# EAGLE schematic TX16S_enhanced (EAGLE 7.7.0)
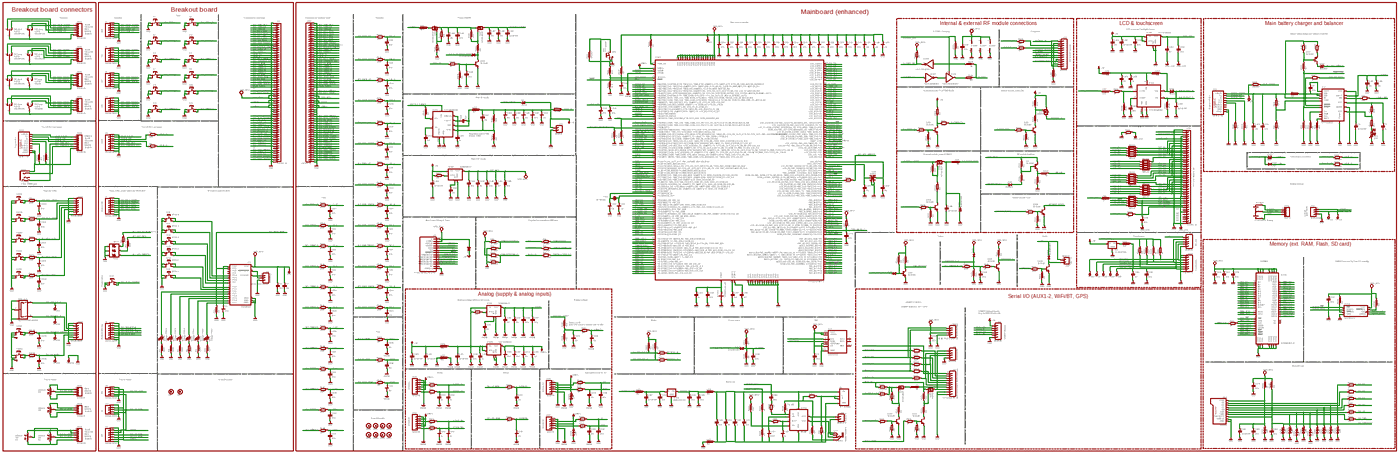
[diagram p0: schematic, sheet 1, overview]
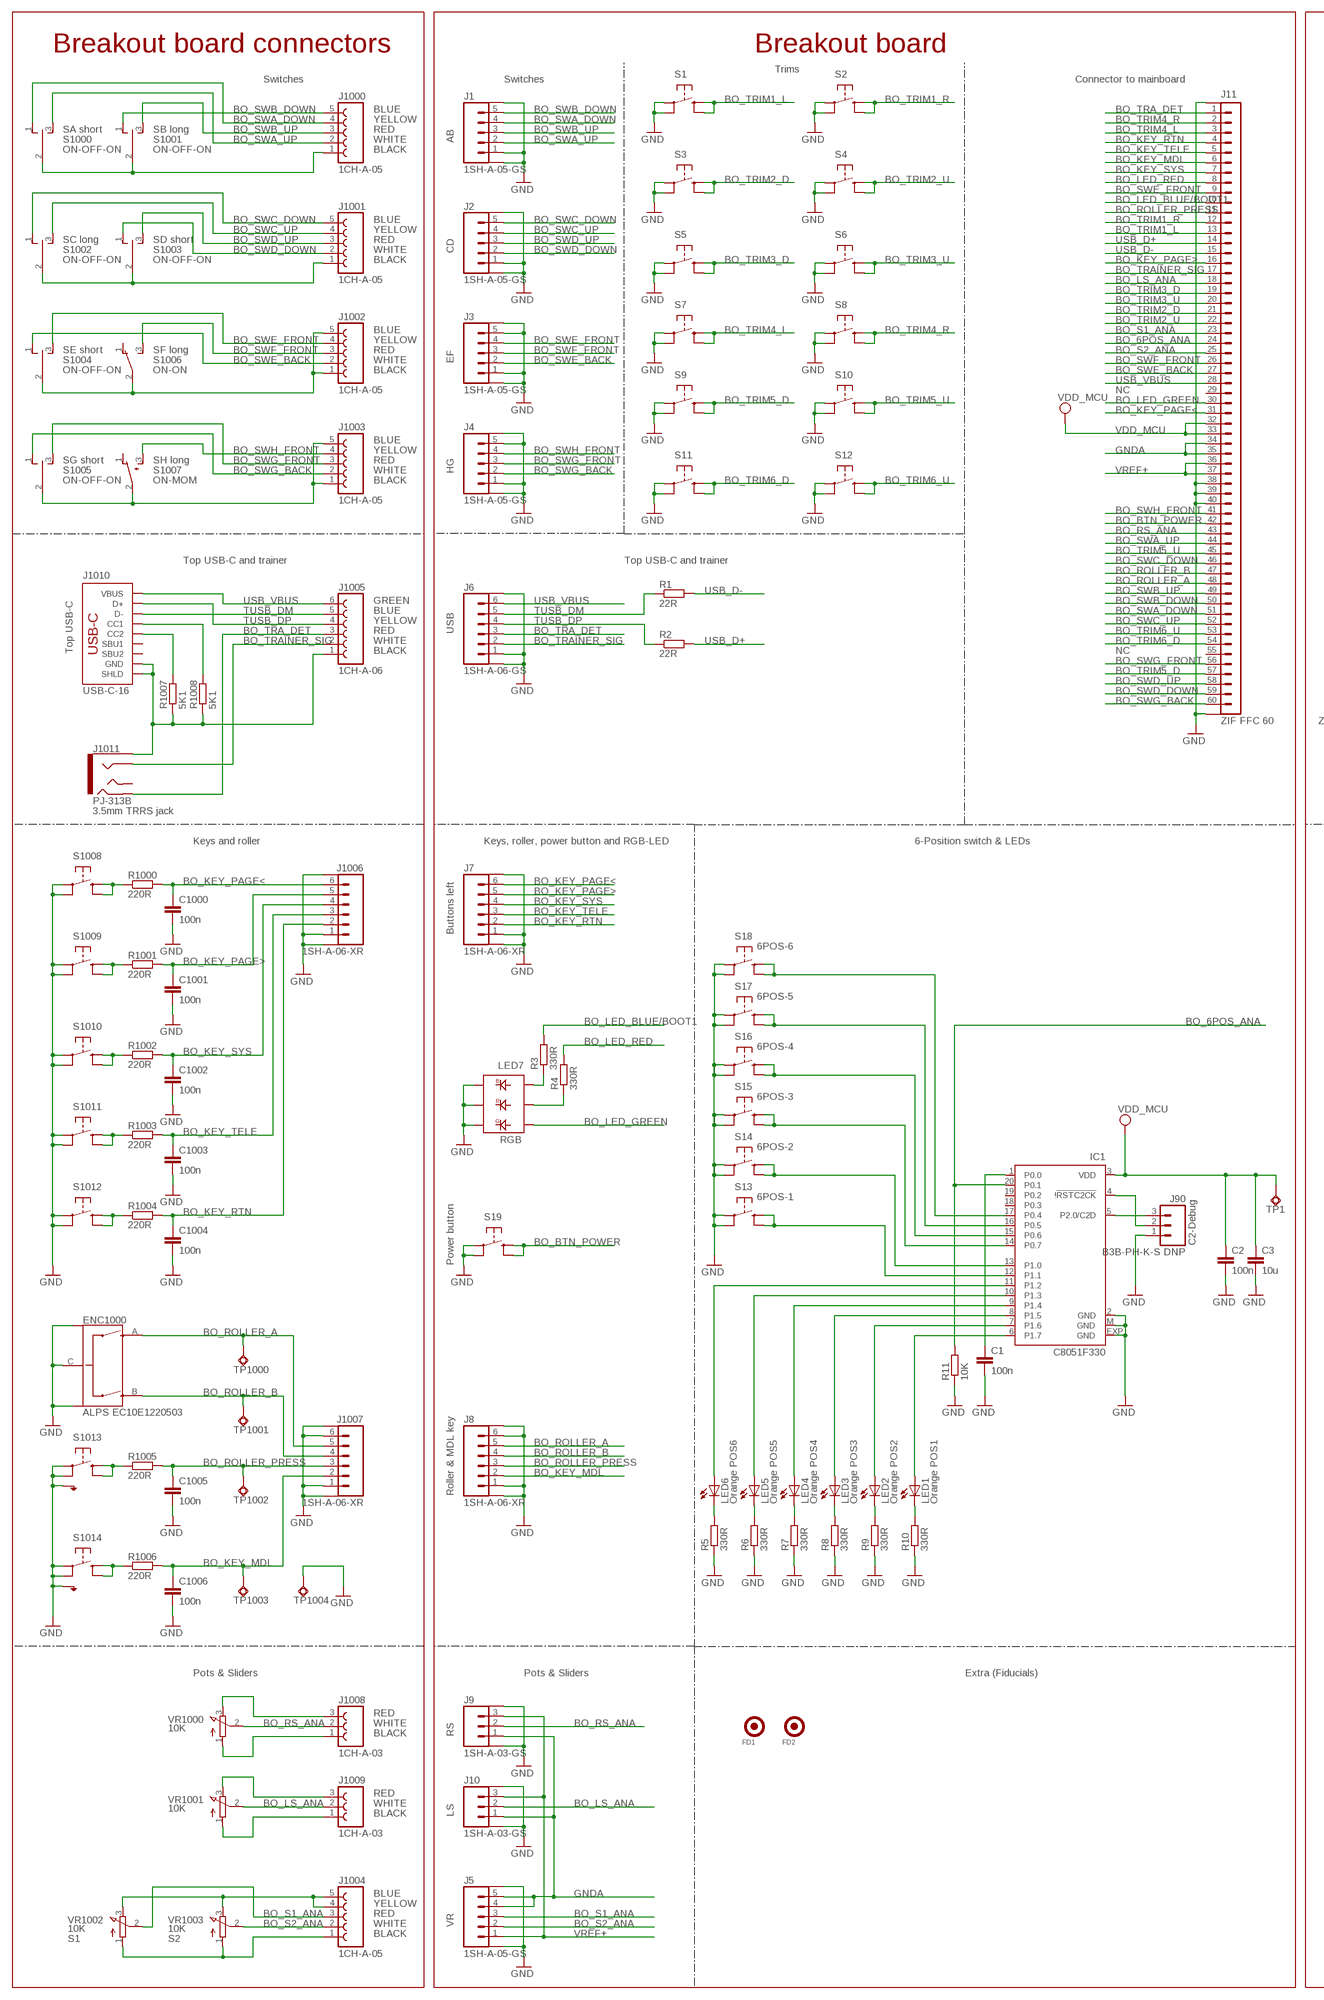
[diagram p1: schematic, sheet 1, part 1 of 4]
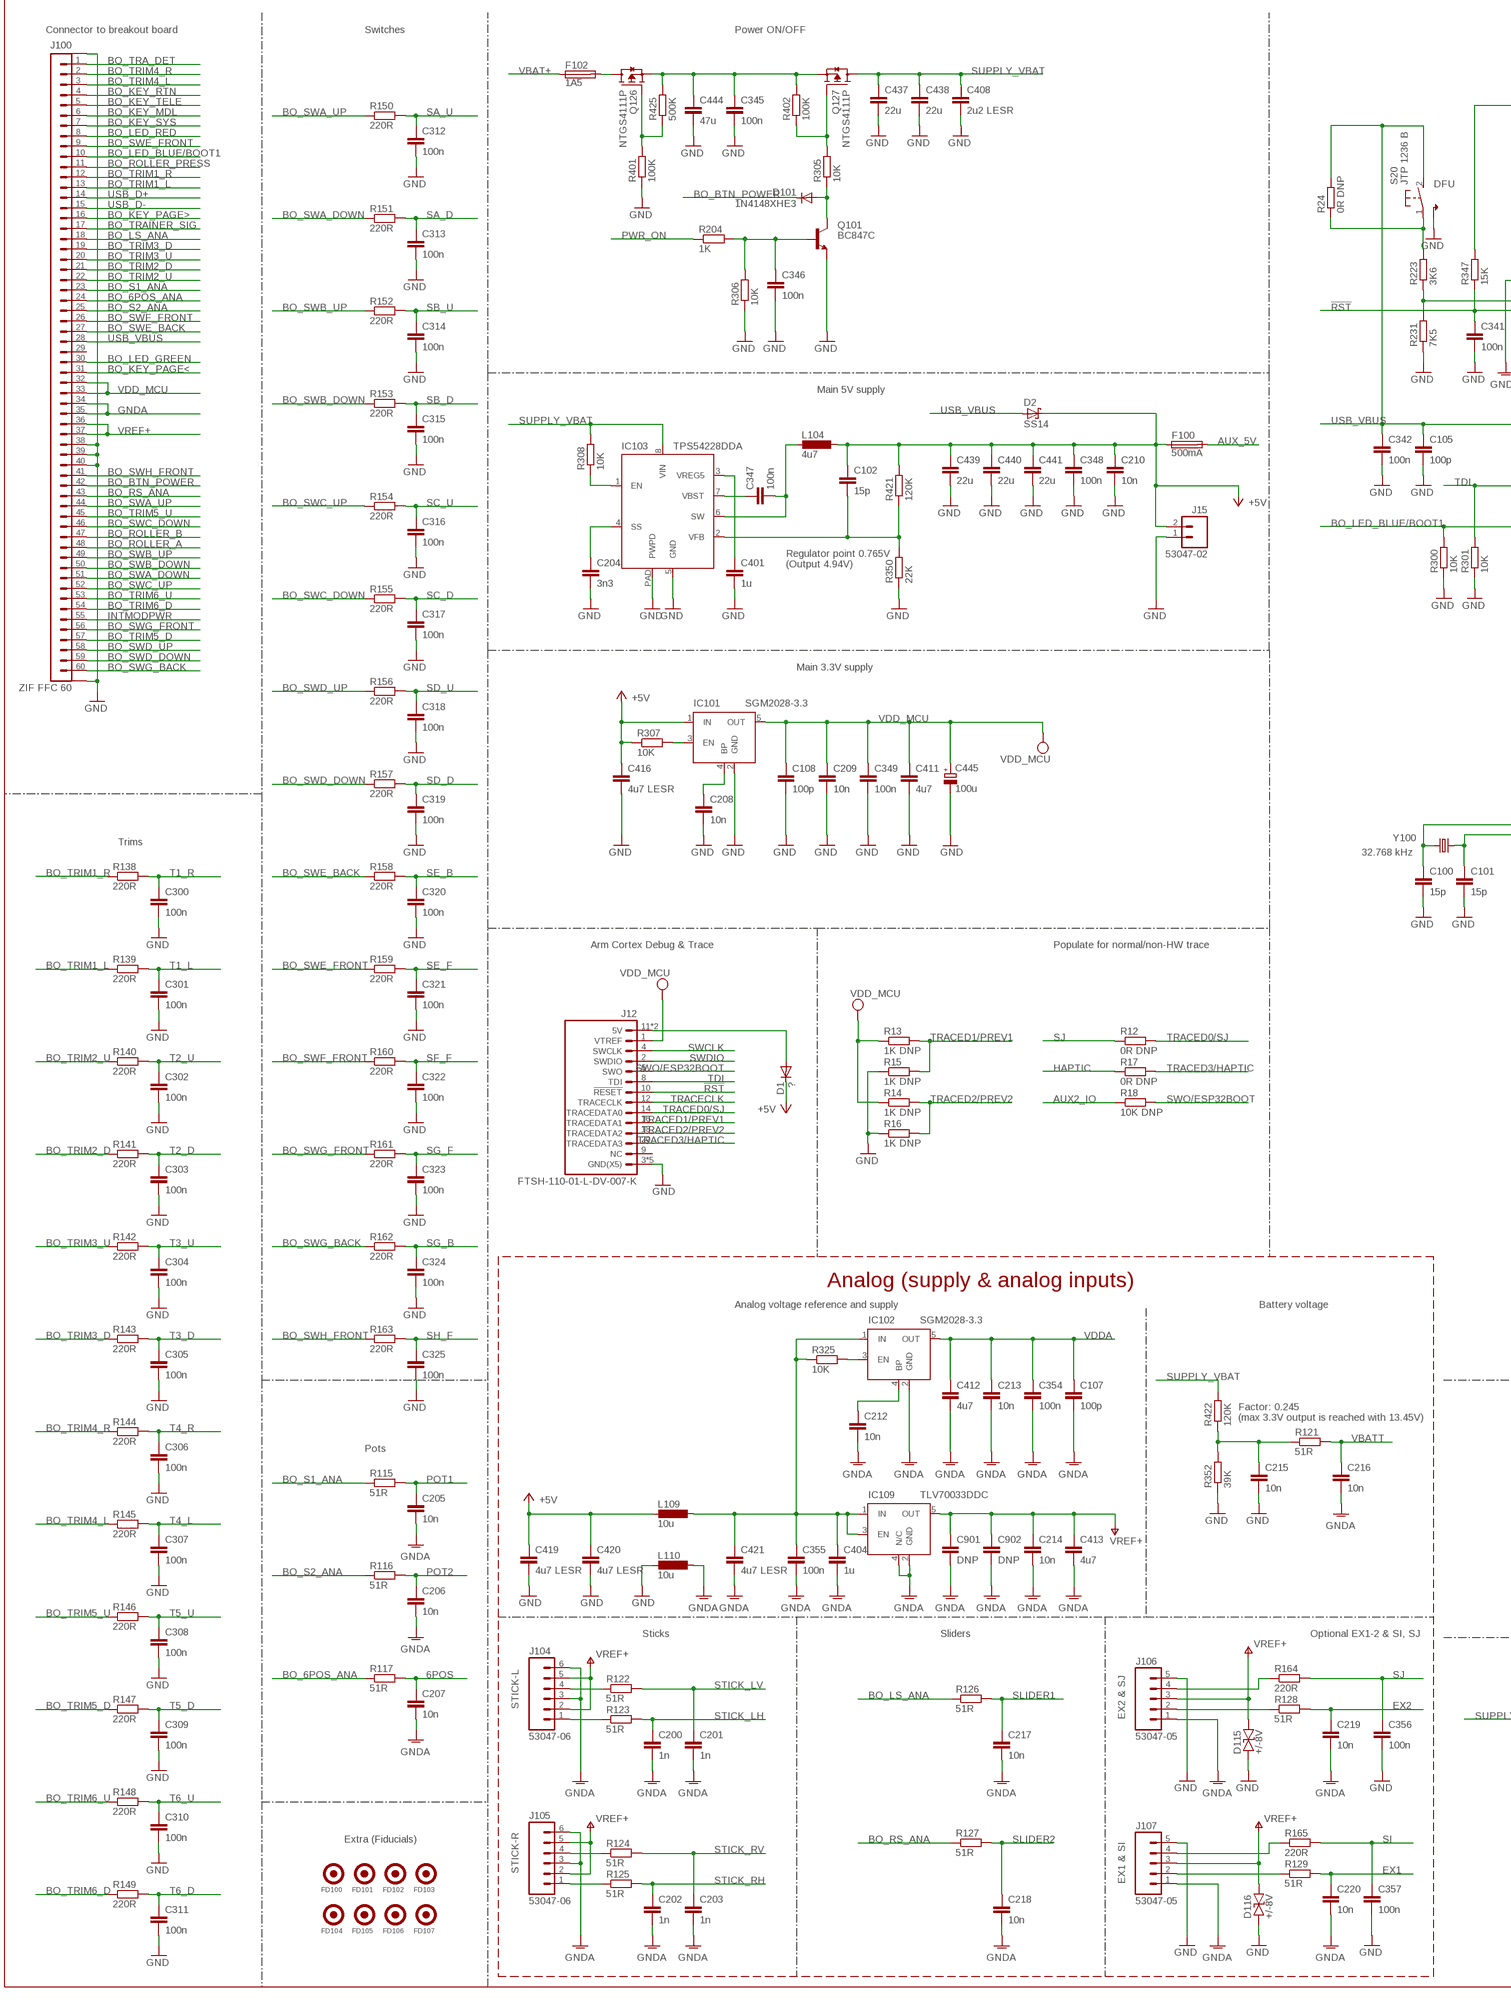
[diagram p2: schematic, sheet 1, part 2 of 4]
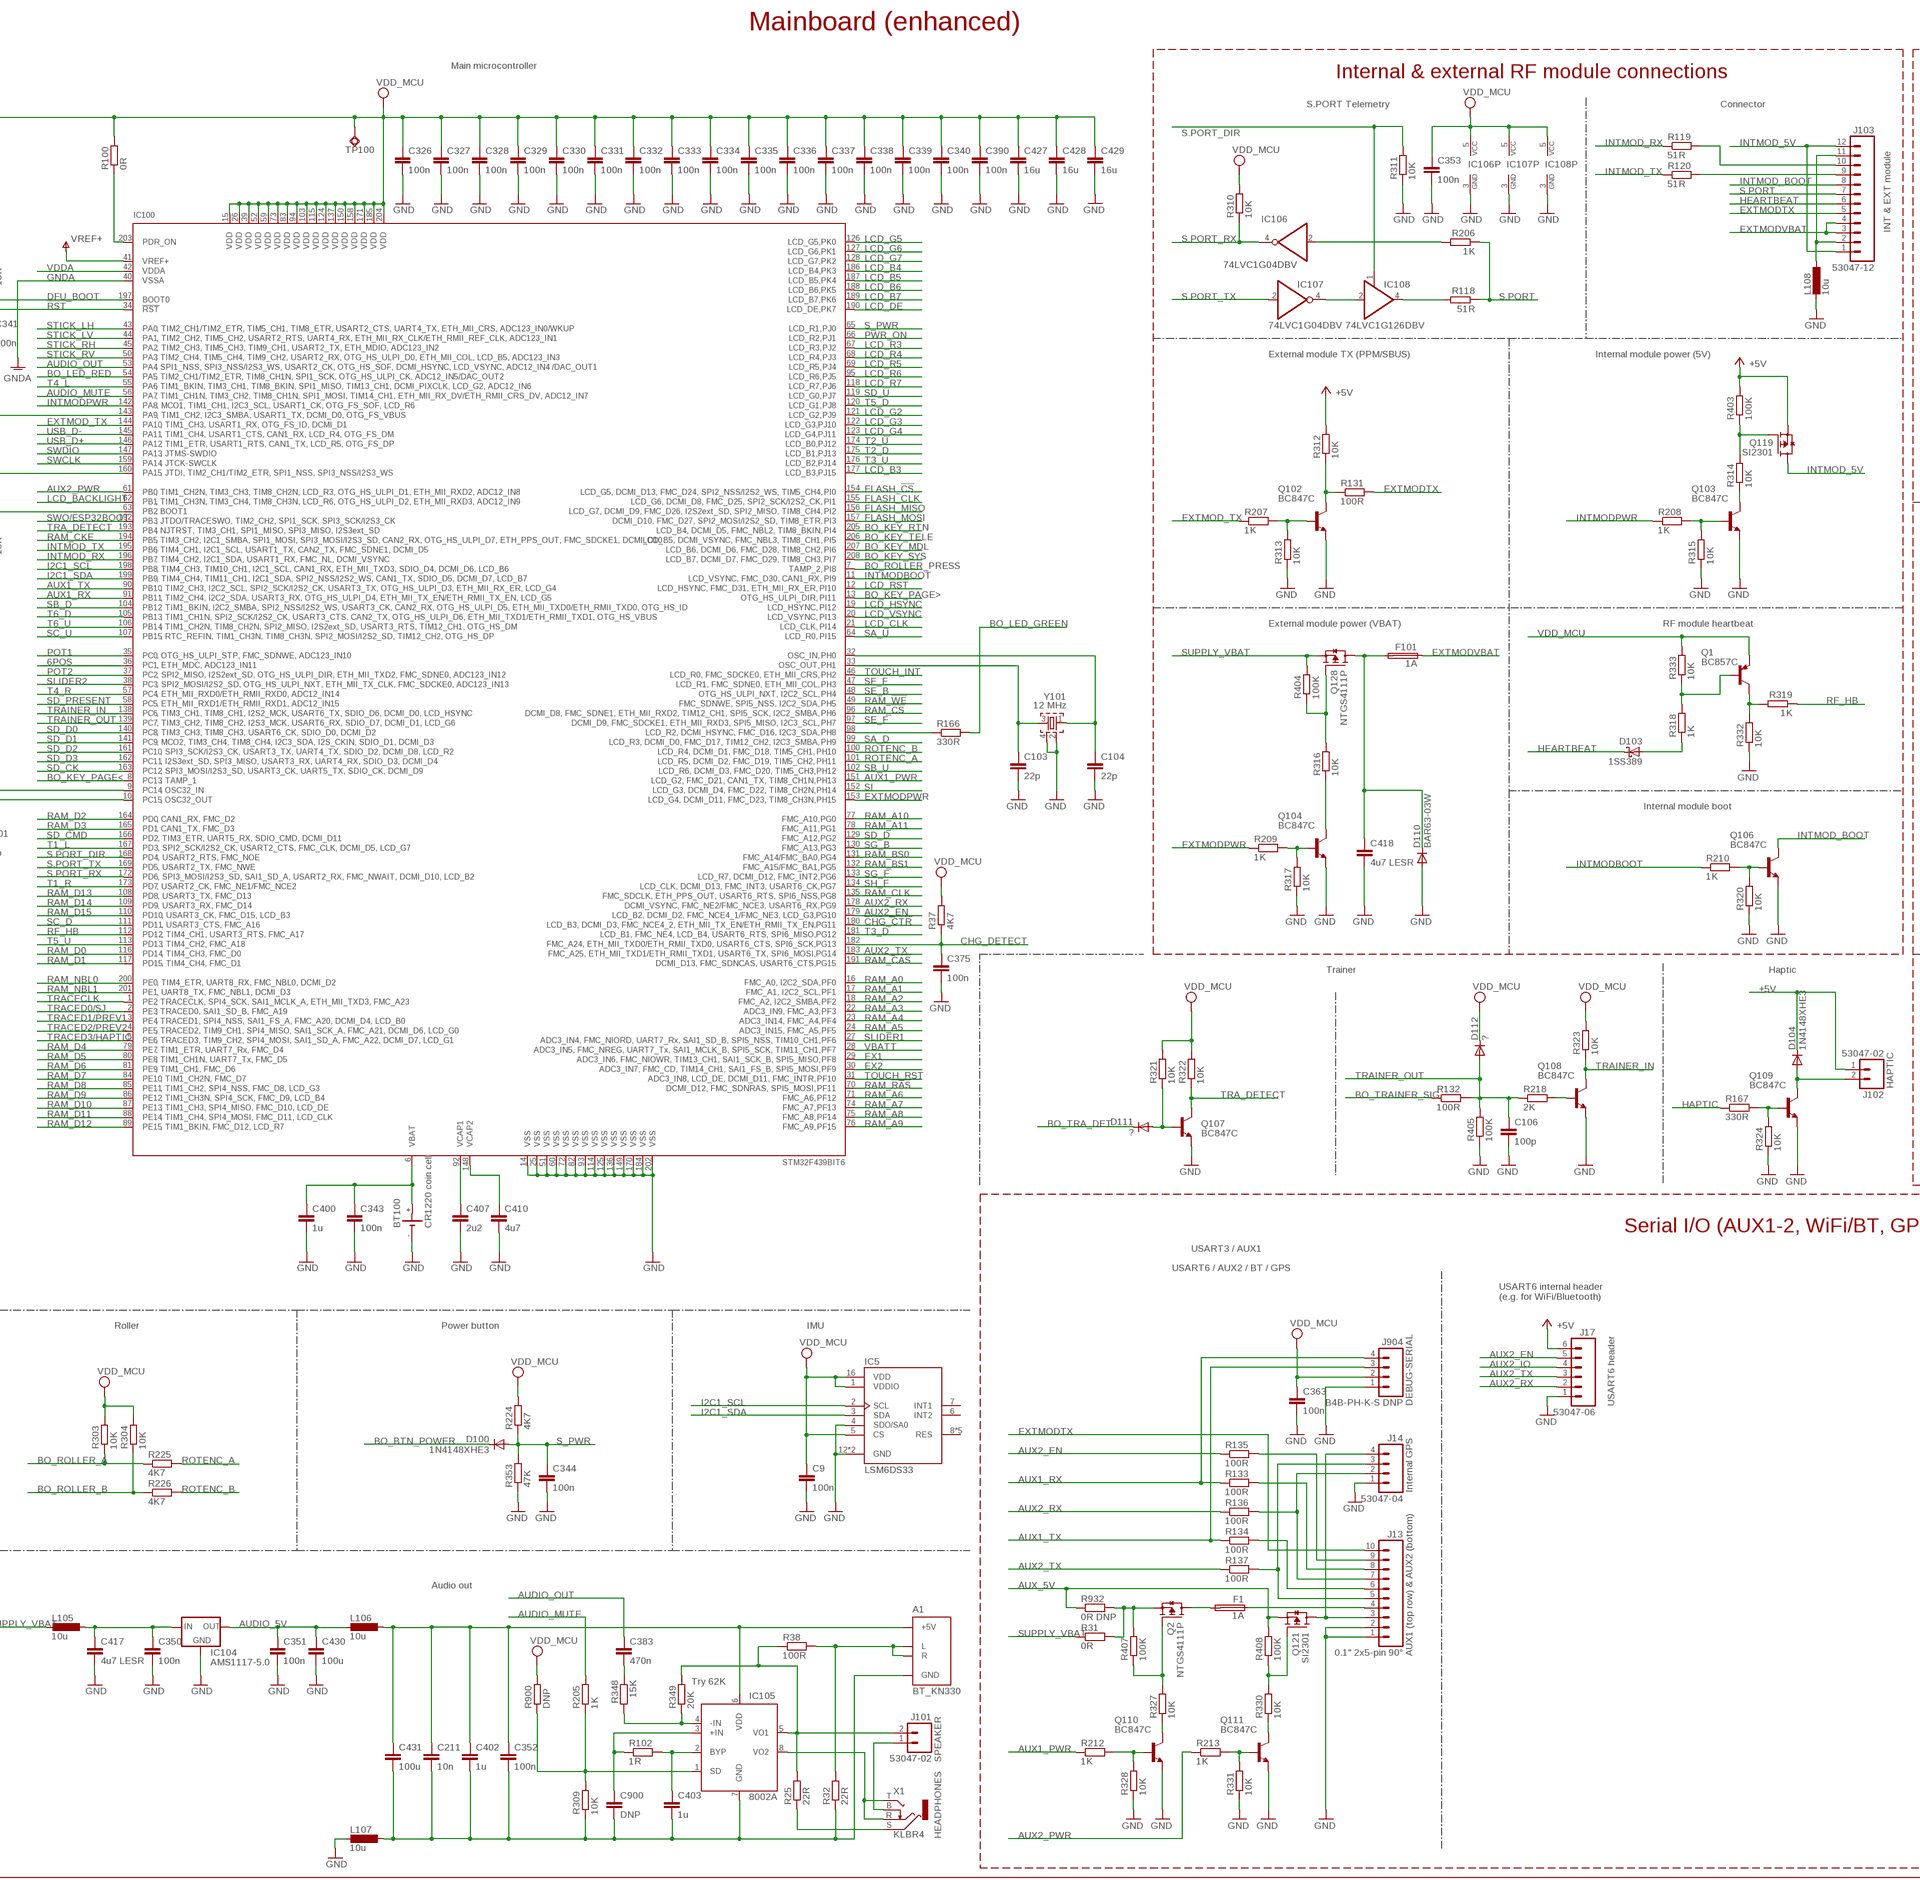
[diagram p3: schematic, sheet 1, part 3 of 4]
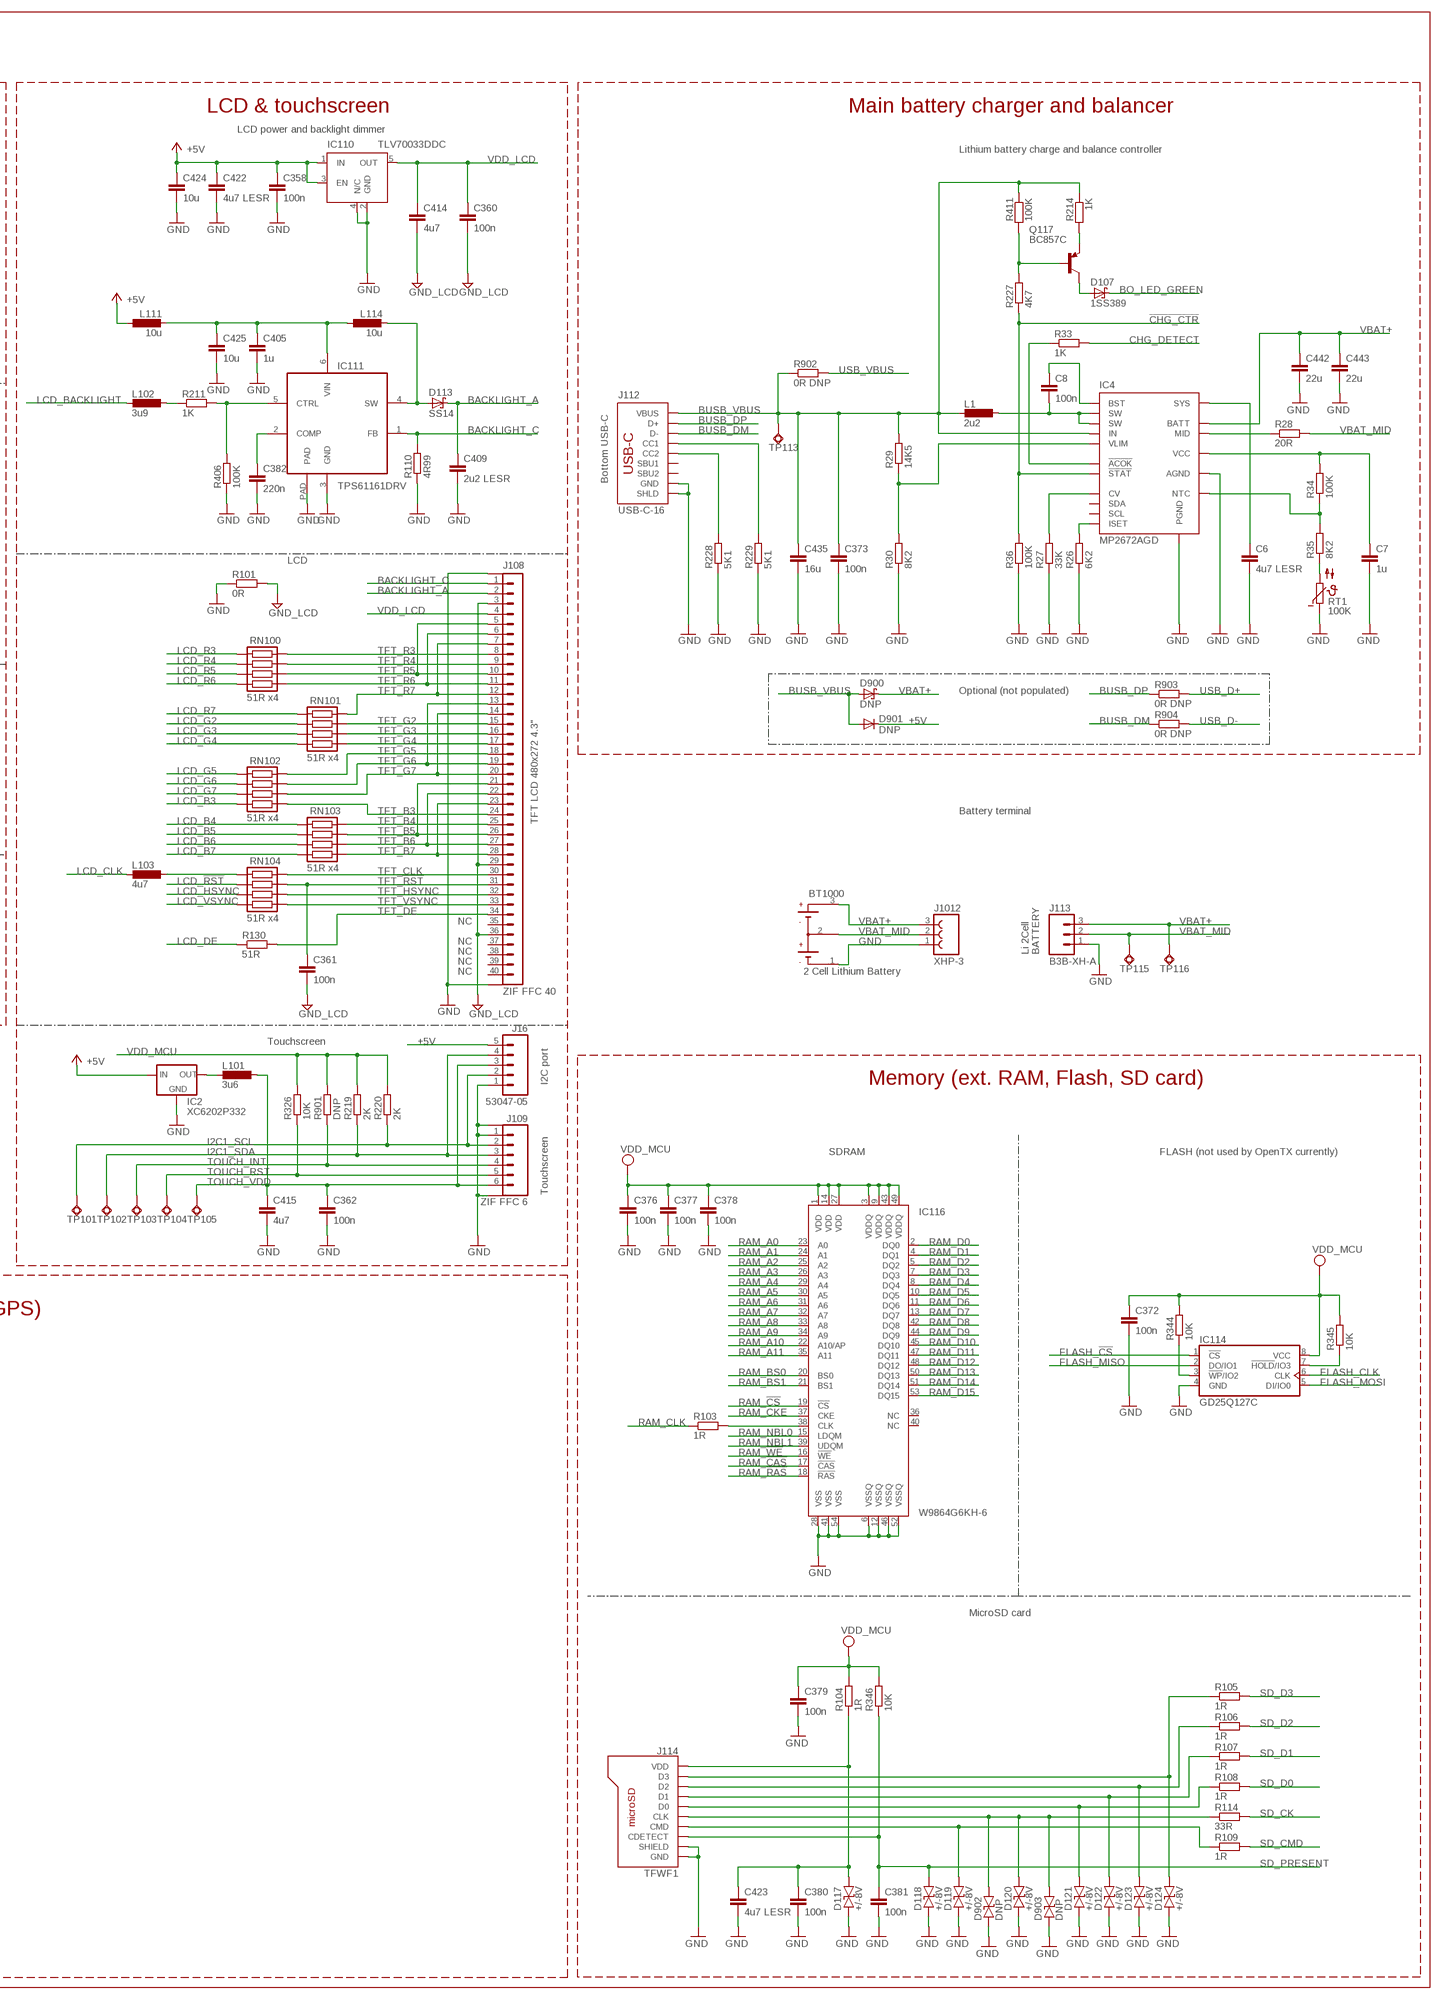
[diagram p4: schematic, sheet 1, part 4 of 4]

## Parts
A1  BT_KN330  [BT_KN330]
BT100  CR1220 coin cell  CH291-1220LF  [CH291-1220LF]
BT1000  2 Cell Lithium Battery  LIBATT_2S_5000  [BATTERY_2S_5000]
C1  100n  C-EUC0402  [C0402]
C2  100n  C-EUC0402  [C0402]
C3  10u  C-EUC0402  [C0402]
C6  4u7 LESR  C-EUC2012  [C2012]
C7  1u  C-EUC0603  [C0603]
C8  100n  C-EUC0603  [C0603]
C9  100n  C-EUC0603  [C0603]
C100  15p  C-EUC0402  [C0402]
C101  15p  C-EUC0402  [C0402]
C102  15p  C-EUC0402  [C0402]
C103  22p  C-EUC0402  [C0402]
C104  22p  C-EUC0402  [C0402]
C105  100p  C-EUC0402  [C0402]
C106  100p  C-EUC0402  [C0402]
C107  100p  C-EUC0402  [C0402]
C108  100p  C-EUC0402  [C0402]
C200  1n  C-EUC0402  [C0402]
C201  1n  C-EUC0402  [C0402]
C202  1n  C-EUC0402  [C0402]
C203  1n  C-EUC0402  [C0402]
C204  3n3  C-EUC0402  [C0402]
C205  10n  C-EUC0402  [C0402]
C206  10n  C-EUC0402  [C0402]
C207  10n  C-EUC0402  [C0402]
C208  10n  C-EUC0402  [C0402]
C209  10n  C-EUC0402  [C0402]
C210  10n  C-EUC0402  [C0402]
C211  10n  C-EUC0402  [C0402]
C212  10n  C-EUC0402  [C0402]
C213  10n  C-EUC0402  [C0402]
C214  10n  C-EUC0402  [C0402]
C215  10n  C-EUC0402  [C0402]
C216  10n  C-EUC0402  [C0402]
C217  10n  C-EUC0402  [C0402]
C218  10n  C-EUC0402  [C0402]
C219  10n  C-EUC0402  [C0402]
C220  10n  C-EUC0603  [C0603]
C300  100n  C-EUC0402  [C0402]
C301  100n  C-EUC0402  [C0402]
C302  100n  C-EUC0402  [C0402]
C303  100n  C-EUC0402  [C0402]
C304  100n  C-EUC0402  [C0402]
C305  100n  C-EUC0402  [C0402]
C306  100n  C-EUC0402  [C0402]
C307  100n  C-EUC0402  [C0402]
C308  100n  C-EUC0402  [C0402]
C309  100n  C-EUC0402  [C0402]
C310  100n  C-EUC0402  [C0402]
C311  100n  C-EUC0402  [C0402]
C312  100n  C-EUC0402  [C0402]
C313  100n  C-EUC0402  [C0402]
C314  100n  C-EUC0402  [C0402]
C315  100n  C-EUC0402  [C0402]
C316  100n  C-EUC0402  [C0402]
C317  100n  C-EUC0402  [C0402]
C318  100n  C-EUC0402  [C0402]
C319  100n  C-EUC0402  [C0402]
C320  100n  C-EUC0402  [C0402]
C321  100n  C-EUC0402  [C0402]
C322  100n  C-EUC0402  [C0402]
C323  100n  C-EUC0402  [C0402]
C324  100n  C-EUC0402  [C0402]
C325  100n  C-EUC0402  [C0402]
C326  100n  C-EUC0402  [C0402]
C327  100n  C-EUC0402  [C0402]
C328  100n  C-EUC0402  [C0402]
C329  100n  C-EUC0402  [C0402]
C330  100n  C-EUC0402  [C0402]
C331  100n  C-EUC0402  [C0402]
C332  100n  C-EUC0402  [C0402]
C333  100n  C-EUC0402  [C0402]
C334  100n  C-EUC0402  [C0402]
C335  100n  C-EUC0402  [C0402]
C336  100n  C-EUC0402  [C0402]
C337  100n  C-EUC0402  [C0402]
C338  100n  C-EUC0402  [C0402]
C339  100n  C-EUC0402  [C0402]
C340  100n  C-EUC0402  [C0402]
C341  100n  C-EUC0402  [C0402]
C342  100n  C-EUC0402  [C0402]
C343  100n  C-EUC0402  [C0402]
C344  100n  C-EUC0402  [C0402]
C345  100n  C-EUC0402  [C0402]
C346  100n  C-EUC0402  [C0402]
C347  100n  C-EUC0402  [C0402]
C348  100n  C-EUC0402  [C0402]
C349  100n  C-EUC0402  [C0402]
C350  100n  C-EUC0402  [C0402]
C351  100n  C-EUC0402  [C0402]
C352  100n  C-EUC0402  [C0402]
C353  100n  C-EUC0603  [C0603]
C354  100n  C-EUC0402  [C0402]
C355  100n  C-EUC0402  [C0402]
C356  100n  C-EUC0402  [C0402]
C357  100n  C-EUC0603  [C0603]
C358  100n  C-EUC0402  [C0402]
C360  100n  C-EUC0402  [C0402]
C361  100n  C-EUC0402  [C0402]
C362  100n  C-EUC0603  [C0603]
C363  100n  C-EUC0402  [C0402]
C372  100n  C-EUC0603  [C0603]
C373  100n  C-EUC0603  [C0603]
C375  100n  C-EUC0603  [C0603]
C376  100n  C-EUC0402  [C0402]
C377  100n  C-EUC0402  [C0402]
C378  100n  C-EUC0402  [C0402]
C379  100n  C-EUC0402  [C0402]
C380  100n  C-EUC0603  [C0603]
C381  100n  C-EUC0402  [C0402]
C382  220n  C-EUC0402  [C0402]
C383  470n  C-EUC0402  [C0402]
C390  100n  C-EUC0402  [C0402]
C400  1u  C-EUC0402  [C0402]
C401  1u  C-EUC0402  [C0402]
C402  1u  C-EUC0402  [C0402]
C403  1u  C-EUC0402  [C0402]
C404  1u  C-EUC0402  [C0402]
C405  1u  C-EUC0402  [C0402]
C407  2u2  C-EUC0402  [C0402]
C408  2u2 LESR  C-EUC0603  [C0603]
C409  2u2 LESR  C-EUC0603  [C0603]
C410  4u7  C-EUC0603  [C0603]
C411  4u7  C-EUC0402  [C0402]
C412  4u7  C-EUC0402  [C0402]
C413  4u7  C-EUC0402  [C0402]
C414  4u7  C-EUC0402  [C0402]
C415  4u7  C-EUC0603  [C0603]
C416  4u7 LESR  C-EUC2012  [C2012]
C417  4u7 LESR  C-EUC2012  [C2012]
C418  4u7 LESR  C-EUC2012  [C2012]
C419  4u7 LESR  C-EUC2012  [C2012]
C420  4u7 LESR  C-EUC2012  [C2012]
C421  4u7 LESR  C-EUC2012  [C2012]
C422  4u7 LESR  C-EUC2012  [C2012]
C423  4u7 LESR  C-EUC2012  [C2012]
C424  10u  C-EUC2012  [C2012]
C425  10u  C-EUC2012  [C2012]
C427  16u  C-EUC2012  [C2012]
C428  16u  C-EUC2012  [C2012]
C429  16u  C-EUC2012  [C2012]
C430  100u  C-EUC3225  [C3225]
C431  100u  C-EUC3225  [C3225]
C435  16u  C-EUC2012  [C2012]
C437  22u  C-EUC3216  [C3216]
C438  22u  C-EUC3216  [C3216]
C439  22u  C-EUC3216  [C3216]
C440  22u  C-EUC3216  [C3216]
C441  22u  C-EUC3216  [C3216]
C442  22u  C-EUC3216  [C3216]
C443  22u  C-EUC3216  [C3216]
C444  47u  C-EUC3216  [C3216]
C445  100u  CPOL-EUSMCD  [SMC_D]
C900  DNP  C-EUC0402  [C0402]
C901  DNP  C-EUC0402  [C0402]
C902  DNP  C-EUC0402  [C0402]
C1000  100n  C-EUC0402  [C0402]
C1001  100n  C-EUC0402  [C0402]
C1002  100n  C-EUC0402  [C0402]
C1003  100n  C-EUC0402  [C0402]
C1004  100n  C-EUC0402  [C0402]
C1005  100n  C-EUC0805  [C0805]
C1006  100n  C-EUC0805  [C0805]
D1  ?  DIODE-SOD523  [SOD523]
D2  SS14  SS34  [DO-214AC]
D100  1N4148XHE3  [SOD523]
D101  1N4148XHE3  [SOD523]
D103  1SS389  [SOD523]
D104  1N4148XHE3  [SOD523]
D107  1SS389  [SOD523]
D110  BAR63-03W  DIODE-SOD323-R  [SOD323-R]
D111  ?  DIODE-SOD523  [SOD523]
D112  ?  DIODE-SOD523  [SOD523]
D113  SS14  SS34  [DO-214AC]
D115  +/-8V  TVS-BIDIR  [DFN1006-2L]
D116  +/-8V  TVS-BIDIR  [DFN1006-2L]
D117  +/-8V  TVS-BIDIR  [DFN1006-2L]
D118  +/-8V  TVS-BIDIR  [DFN1006-2L]
D119  +/-8V  TVS-BIDIR  [DFN1006-2L]
D120  +/-8V  TVS-BIDIR  [DFN1006-2L]
D121  +/-8V  TVS-BIDIR  [DFN1006-2L]
D122  +/-8V  TVS-BIDIR  [DFN1006-2L]
D123  +/-8V  TVS-BIDIR  [DFN1006-2L]
D124  +/-8V  TVS-BIDIR  [DFN1006-2L]
D900  DNP  SS34  [DO-214AC]
D901  DNP  1N4148XHE3  [SOD523]
D902  DNP  TVS-BIDIR  [DFN1006-2L]
D903  DNP  TVS-BIDIR  [DFN1006-2L]
ENC1000  ALPS EC10E1220503  ALPS_EC10E  [APLS_EC10E]
F1  1A  FUSE_1206  [1206]
F100  500mA  FUSE_1206  [1206]
F101  1A  FUSE_1206  [1206]
F102  1A5  FUSE_1206  [1206]
FD1  FIDUCIAL  [FIDUCIAL]
FD2  FIDUCIAL  [FIDUCIAL]
FD100  FIDUCIAL  [FIDUCIAL]
FD101  FIDUCIAL  [FIDUCIAL]
FD102  FIDUCIAL  [FIDUCIAL]
FD103  FIDUCIAL  [FIDUCIAL]
FD104  FIDUCIAL  [FIDUCIAL]
FD105  FIDUCIAL  [FIDUCIAL]
FD106  FIDUCIAL  [FIDUCIAL]
FD107  FIDUCIAL  [FIDUCIAL]
IC1  C8051F330  C8051F330/1  [MLP20]
IC2  XC6202P332  XC6202P  [SOT-23]
IC4  MP2672AGD  [MP2672A]
IC5  LSM6DS33  [LGA_3X3_16L]
IC100  STM32F439BIT6  STM32F42XBXT  [LQFP208]
IC101  SGM2028-3.3  SGM2028  [SOT23-5]
IC102  SGM2028-3.3  SGM2028  [SOT23-5]
IC103  TPS54228DDA  [HSOP-8]
IC104  AMS1117-5.0  AMS1117  [SOT-223]
IC105  8002A  [SOP-8]
IC106  74LVC1G04DBV  [SOT23-5]
IC107  74LVC1G04DBV  [SOT23-5]
IC108  74LVC1G126DBV  [SOT23-5]
IC109  TLV70033DDC  TLV700  [SOT23-5]
IC110  TLV70033DDC  TLV700  [SOT23-5]
IC111  TPS61161DRV  [WSON6]
IC114  GD25Q127C  [SOP-8_208MIL]
IC116  W9864G6KH-6  W9864G6KH  [TSOP_II_54]
J1  1SH-A-05-GS  AT_1SH-A-05-XS  [AT_1SH-A-05-XS]
J2  1SH-A-05-GS  AT_1SH-A-05-XS  [AT_1SH-A-05-XS]
J3  1SH-A-05-GS  AT_1SH-A-05-XS  [AT_1SH-A-05-XS]
J4  1SH-A-05-GS  AT_1SH-A-05-XS  [AT_1SH-A-05-XS]
J5  1SH-A-05-GS  AT_1SH-A-05-XS  [AT_1SH-A-05-XS]
J6  1SH-A-06-GS  AT_1SH_A_06-XS  [AT_1SH-A-06-XS]
J7  1SH-A-06-XR  AT_1SH-A-06-XR  [AT_1SH-A-06-XR]
J8  1SH-A-06-XR  AT_1SH-A-06-XR  [AT_1SH-A-06-XR]
J9  1SH-A-03-GS  AT_1SH-A-03-XS  [AT_1SH-A-03-XS]
J10  1SH-A-03-GS  AT_1SH-A-03-XS  [AT_1SH-A-03-XS]
J11  ZIF FFC 60  CON-FFC-60-REV  [CON-FFC-60-REV]
J12  FTSH-110-01-L-DV-007-K  CORTEX_DEBUG_TRACE  [FTSH-110]
J13  0.1" 2x5-pin 90°  PH2.54-5W2  [PH2.54-5W2]
J14  53047-04  MOLEX_53047-04  [MOLEX_53047-04]
J15  53047-02  MOLEX_53047-02  [MOLEX_53047-02]
J16  53047-05  MOLEX_53047-05  [MOLEX_53047-05]
J17  53047-06  MOLEX_53047-06  [MOLEX_53047-06]
J90  B3B-PH-K-S DNP  JST_B3B-PH-K-S  [JST_B3B_PH-K-S]
J100  ZIF FFC 60  CON-FFC-60  [CON-FFC-60]
J101  53047-02  MOLEX_53047-02  [MOLEX_53047-02]
J102  53047-02  MOLEX_53047-02  [MOLEX_53047-02]
J103  53047-12  MOLEX_53047-12  [MOLEX_53047-12]
J104  53047-06  MOLEX_53047-06  [MOLEX_53047-06]
J105  53047-06  MOLEX_53047-06  [MOLEX_53047-06]
J106  53047-05  MOLEX_53047-05  [MOLEX_53047-05]
J107  53047-05  MOLEX_53047-05  [MOLEX_53047-05]
J108  ZIF FFC 40  CON-FFC-40  [CON-FFC-40]
J109  ZIF FFC 6  CON-FFC-6-REV  [CON-FFC-6]
J112  USB-C-16  [USB-C-16]
J113  B3B-XH-A  JST_B3B-XH-A  [JST_B3B-XH-A]
J114  TFWF1  [TFWF1]
J904  B4B-PH-K-S DNP  JST_B4B-PH-K-S  [JST_B4B_PH-K-S]
J1000  1CH-A-05  CON5F  [PADS_5_1MM]
J1001  1CH-A-05  CON5F  [PADS_5_1MM]
J1002  1CH-A-05  CON5F  [PADS_5_1MM]
J1003  1CH-A-05  CON5F  [PADS_5_1MM]
J1004  1CH-A-05  CON5F  [PADS_5_1MM]
J1005  1CH-A-06  CON6F  [PADS_6_1MM]
J1006  1SH-A-06-XR  AT_1SH-A-06-XR-REVORDER  [AT_1SH-A-06-XR-REV]
J1007  1SH-A-06-XR  AT_1SH-A-06-XR-REVORDER  [AT_1SH-A-06-XR-REV]
J1008  1CH-A-03  CON3F  [PADS_3_1MM]
J1009  1CH-A-03  CON3F  [PADS_3_1MM]
J1010  USB-C-16  [USB-C-16]
J1011  PJ-313B  [PJ-313B]
J1012  XHP-3  JST_XHP-3  [JST_XHP-3]
L1  2u2  L-EUPIS2816  [PIS2816]
L101  3u6  L0603  [0603]
L102  3u9  L0603  [0603]
L103  4u7  L0603  [0603]
L104  4u7  L-EUPIS2816  [PIS2816]
L105  10u  L-EUL3225M  [L3225M]
L106  10u  L-EUL3225M  [L3225M]
L107  10u  L-EUL3225M  [L3225M]
L108  10u  L0603  [0603]
L109  10u  L0603  [0603]
L110  10u  L0603  [0603]
L111  10u  L0603  [0603]
L114  10u  L-EUPIS2816  [PIS2816]
LED1  Orange POS1  LEDSML0603  [SML0603]
LED2  Orange POS2  LEDSML0603  [SML0603]
LED3  Orange POS3  LEDSML0603  [SML0603]
LED4  Orange POS4  LEDSML0603  [SML0603]
LED5  Orange POS5  LEDSML0603  [SML0603]
LED6  Orange POS6  LEDSML0603  [SML0603]
LED7  RGB  LED-RGB  [PLCC-6]
Q1  BC857C  SS8550  [SOT-23]
Q2  NTGS4111P  [TSOP-6]
Q101  BC847C  S8050  [SOT-23]
Q102  BC847C  S8050  [SOT-23]
Q103  BC847C  S8050  [SOT-23]
Q104  BC847C  S8050  [SOT-23]
Q106  BC847C  S8050  [SOT-23]
Q107  BC847C  S8050  [SOT-23]
Q108  BC847C  S8050  [SOT-23]
Q109  BC847C  S8050  [SOT-23]
Q110  BC847C  S8050  [SOT-23]
Q111  BC847C  S8050  [SOT-23]
Q117  BC857C  SS8550  [SOT-23]
Q119  SI2301  [SOT-23]
Q121  SI2301  [SOT-23]
Q126  NTGS4111P  [TSOP-6]
Q127  NTGS4111P  [TSOP-6]
Q128  NTGS4111P  [TSOP-6]
R1  22R  R-EU_R0402  [R0402]
R2  22R  R-EU_R0402  [R0402]
R3  330R  R-EU_R0402  [R0402]
R4  330R  R-EU_R0402  [R0402]
R5  330R  R-EU_R0402  [R0402]
R6  330R  R-EU_R0402  [R0402]
R7  330R  R-EU_R0402  [R0402]
R8  330R  R-EU_R0402  [R0402]
R9  330R  R-EU_R0402  [R0402]
R10  330R  R-EU_R0402  [R0402]
R11  10K  R-EU_R0402  [R0402]
R12  0R DNP  R-EU_R0402  [R0402]
R13  1K DNP  R-EU_R0402  [R0402]
R14  1K DNP  R-EU_R0402  [R0402]
R15  1K DNP  R-EU_R0402  [R0402]
R16  1K DNP  R-EU_R0402  [R0402]
R17  0R DNP  R-EU_R0402  [R0402]
R18  10K DNP  R-EU_R0603  [R0603]
R24  0R DNP  R-EU_R0402  [R0402]
R25  22R  R-EU_R1206  [R1206]
R26  6K2  R-EU_R0603  [R0603]
R27  33K  R-EU_R0603  [R0603]
R28  20R  R-EU_R2010  [R2010]
R29  14K5  R-EU_R0603  [R0603]
R30  8K2  R-EU_R0603  [R0603]
R31  0R  R-EU_R0603  [R0603]
R32  22R  R-EU_R0603  [R0603]
R33  1K  R-EU_R0603  [R0603]
R34  100K  R-EU_R0603  [R0603]
R35  8K2  R-EU_R0603  [R0603]
R36  100K  R-EU_R0603  [R0603]
R37  4K7  R-EU_R0603  [R0603]
R38  100R  R-EU_R0603  [R0603]
R100  0R  R-EU_R0402  [R0402]
R101  0R  R-EU_R0603  [R0603]
R102  1R  R-EU_R0402  [R0402]
R103  1R  R-EU_R0402  [R0402]
R104  1R  R-EU_R0402  [R0402]
R105  1R  R-EU_R0402  [R0402]
R106  1R  R-EU_R0402  [R0402]
R107  1R  R-EU_R0402  [R0402]
R108  1R  R-EU_R0402  [R0402]
R109  1R  R-EU_R0402  [R0402]
R110  4R99  R-EU_R0805  [R0805]
R114  33R  R-EU_R0402  [R0402]
R115  51R  R-EU_R0402  [R0402]
R116  51R  R-EU_R0402  [R0402]
R117  51R  R-EU_R0402  [R0402]
R118  51R  R-EU_R0402  [R0402]
R119  51R  R-EU_R0402  [R0402]
R120  51R  R-EU_R0402  [R0402]
R121  51R  R-EU_R0402  [R0402]
R122  51R  R-EU_R0402  [R0402]
R123  51R  R-EU_R0402  [R0402]
R124  51R  R-EU_R0402  [R0402]
R125  51R  R-EU_R0402  [R0402]
R126  51R  R-EU_R0402  [R0402]
R127  51R  R-EU_R0402  [R0402]
R128  51R  R-EU_R0402  [R0402]
R129  51R  R-EU_R0603  [R0603]
R130  51R  R-EU_R0402  [R0402]
R131  100R  R-EU_R0603  [R0603]
R132  100R  R-EU_R0402  [R0402]
R133  100R  R-EU_R0603  [R0603]
R134  100R  R-EU_R0603  [R0603]
R135  100R  R-EU_R0402  [R0402]
R136  100R  R-EU_R0402  [R0402]
R137  100R  R-EU_R0402  [R0402]
R138  220R  R-EU_R0402  [R0402]
R139  220R  R-EU_R0402  [R0402]
R140  220R  R-EU_R0402  [R0402]
R141  220R  R-EU_R0402  [R0402]
R142  220R  R-EU_R0402  [R0402]
R143  220R  R-EU_R0402  [R0402]
R144  220R  R-EU_R0402  [R0402]
R145  220R  R-EU_R0402  [R0402]
R146  220R  R-EU_R0402  [R0402]
R147  220R  R-EU_R0402  [R0402]
R148  220R  R-EU_R0402  [R0402]
R149  220R  R-EU_R0402  [R0402]
R150  220R  R-EU_R0402  [R0402]
R151  220R  R-EU_R0402  [R0402]
R152  220R  R-EU_R0402  [R0402]
R153  220R  R-EU_R0402  [R0402]
R154  220R  R-EU_R0402  [R0402]
R155  220R  R-EU_R0402  [R0402]
R156  220R  R-EU_R0402  [R0402]
R157  220R  R-EU_R0402  [R0402]
R158  220R  R-EU_R0402  [R0402]
R159  220R  R-EU_R0402  [R0402]
R160  220R  R-EU_R0402  [R0402]
R161  220R  R-EU_R0402  [R0402]
R162  220R  R-EU_R0402  [R0402]
R163  220R  R-EU_R0402  [R0402]
R164  220R  R-EU_R0402  [R0402]
R165  220R  R-EU_R0603  [R0603]
R166  330R  R-EU_R0402  [R0402]
R167  330R  R-EU_R0402  [R0402]
R204  1K  R-EU_R0402  [R0402]
R205  1K  R-EU_R0402  [R0402]
R206  1K  R-EU_R0402  [R0402]
R207  1K  R-EU_R0402  [R0402]
R208  1K  R-EU_R0402  [R0402]
R209  1K  R-EU_R0402  [R0402]
R210  1K  R-EU_R0402  [R0402]
R211  1K  R-EU_R0402  [R0402]
R212  1K  R-EU_R0603  [R0603]
R213  1K  R-EU_R0603  [R0603]
R214  1K  R-EU_R0402  [R0402]
R218  2K  R-EU_R0402  [R0402]
R219  2K  R-EU_R0603  [R0603]
R220  2K  R-EU_R0603  [R0603]
R223  3K6  R-EU_R0402  [R0402]
R224  4K7  R-EU_R0402  [R0402]
R225  4K7  R-EU_R0402  [R0402]
R226  4K7  R-EU_R0402  [R0402]
R227  4K7  R-EU_R0402  [R0402]
R228  5K1  R-EU_R0402  [R0402]
R229  5K1  R-EU_R0402  [R0402]
R231  7K5  R-EU_R0402  [R0402]
R300  10K  R-EU_R0402  [R0402]
R301  10K  R-EU_R0603  [R0603]
R303  10K  R-EU_R0402  [R0402]
R304  10K  R-EU_R0402  [R0402]
R305  10K  R-EU_R0402  [R0402]
R306  10K  R-EU_R0402  [R0402]
R307  10K  R-EU_R0402  [R0402]
R308  10K  R-EU_R0402  [R0402]
R309  10K  R-EU_R0402  [R0402]
R310  10K  R-EU_R0603  [R0603]
R311  10K  R-EU_R0603  [R0603]
R312  10K  R-EU_R0603  [R0603]
R313  10K  R-EU_R0402  [R0402]
R314  10K  R-EU_R0402  [R0402]
R315  10K  R-EU_R0402  [R0402]
R316  10K  R-EU_R0603  [R0603]
R317  10K  R-EU_R0402  [R0402]
R318  1K  R-EU_R0402  [R0402]
R319  1K  R-EU_R0402  [R0402]
R320  10K  R-EU_R0603  [R0603]
R321  10K  R-EU_R0402  [R0402]
R322  10K  R-EU_R0402  [R0402]
R323  10K  R-EU_R0402  [R0402]
R324  10K  R-EU_R0402  [R0402]
R325  10K  R-EU_R0402  [R0402]
R326  10K  R-EU_R0603  [R0603]
R327  10K  R-EU_R0603  [R0603]
R328  10K  R-EU_R0603  [R0603]
R330  10K  R-EU_R0603  [R0603]
R331  10K  R-EU_R0603  [R0603]
R332  10K  R-EU_R0402  [R0402]
R333  10K  R-EU_R0402  [R0402]
R344  10K  R-EU_R0603  [R0603]
R345  10K  R-EU_R0603  [R0603]
R346  10K  R-EU_R0402  [R0402]
R347  15K  R-EU_R0402  [R0402]
R348  15K  R-EU_R0402  [R0402]
R349  20K  R-EU_R0402  [R0402]
R350  22K  R-EU_R0402  [R0402]
R352  39K  R-EU_R0402  [R0402]
R353  47K  R-EU_R0402  [R0402]
R401  100K  R-EU_R0402  [R0402]
R402  100K  R-EU_R0402  [R0402]
R403  100K  R-EU_R0402  [R0402]
R404  100K  R-EU_R0603  [R0603]
R405  100K  R-EU_R0402  [R0402]
R406  100K  R-EU_R0402  [R0402]
R407  100K  R-EU_R0603  [R0603]
R408  100K  R-EU_R0603  [R0603]
R411  100K  R-EU_R0402  [R0402]
R421  120K  R-EU_R0402  [R0402]
R422  120K  R-EU_R0402  [R0402]
R425  500K  R-EU_R0402  [R0402]
R900  DNP  R-EU_R0402  [R0402]
R901  DNP  R-EU_R0603  [R0603]
R902  0R DNP  R-EU_R0603  [R0603]
R903  0R DNP  R-EU_R0402  [R0402]
R904  0R DNP  R-EU_R0402  [R0402]
R932  0R DNP  R-EU_R0603  [R0603]
R1000  220R  R-EU_R0402  [R0402]
R1001  220R  R-EU_R0402  [R0402]
R1002  220R  R-EU_R0402  [R0402]
R1003  220R  R-EU_R0402  [R0402]
R1004  220R  R-EU_R0402  [R0402]
R1005  220R  R-EU_R0805  [R0805]
R1006  220R  R-EU_R0805  [R0805]
R1007  5K1  R-EU_R0402  [R0402]
R1008  5K1  R-EU_R0402  [R0402]
RN100  51R x4  EXB38V  [EXB38V]
RN101  51R x4  EXB38V  [EXB38V]
RN102  51R x4  EXB38V  [EXB38V]
RN103  51R x4  EXB38V  [EXB38V]
RN104  51R x4  EXB38V  [EXB38V]
RT1  100K  NTC_3MM  [NTC_3MM]
S1  TX16S_BUTTON  [TX16S_BUTTON]
S2  TX16S_BUTTON  [TX16S_BUTTON]
S3  TX16S_BUTTON  [TX16S_BUTTON]
S4  TX16S_BUTTON  [TX16S_BUTTON]
S5  TX16S_BUTTON  [TX16S_BUTTON]
S6  TX16S_BUTTON  [TX16S_BUTTON]
S7  TX16S_BUTTON  [TX16S_BUTTON]
S8  TX16S_BUTTON  [TX16S_BUTTON]
S9  TX16S_BUTTON  [TX16S_BUTTON]
S10  TX16S_BUTTON  [TX16S_BUTTON]
S11  TX16S_BUTTON  [TX16S_BUTTON]
S12  TX16S_BUTTON  [TX16S_BUTTON]
S13  6POS-1  TX16S_BUTTON  [TX16S_BUTTON]
S14  6POS-2  TX16S_BUTTON  [TX16S_BUTTON]
S15  6POS-3  TX16S_BUTTON  [TX16S_BUTTON]
S16  6POS-4  TX16S_BUTTON  [TX16S_BUTTON]
S17  6POS-5  TX16S_BUTTON  [TX16S_BUTTON]
S18  6POS-6  TX16S_BUTTON  [TX16S_BUTTON]
S19  TX16S_BUTTON  [TX16S_BUTTON]
S20  JTP 1236 B  JTP1236B  [JTP1236B]
S1000  ON-OFF-ON  TL39PO  [TL3XPO]
S1001  ON-OFF-ON  TL39PO  [TL3XPO]
S1002  ON-OFF-ON  TL39PO  [TL3XPO]
S1003  ON-OFF-ON  TL39PO  [TL3XPO]
S1004  ON-OFF-ON  TL39PO  [TL3XPO]
S1005  ON-OFF-ON  TL39PO  [TL3XPO]
S1006  ON-ON  TL36PO  [TL3XPO]
S1007  ON-MOM  TL32PO  [TL3XPO]
S1008  TX16S_BUTTON  [TX16S_BUTTON]
S1009  TX16S_BUTTON  [TX16S_BUTTON]
S1010  TX16S_BUTTON  [TX16S_BUTTON]
S1011  TX16S_BUTTON  [TX16S_BUTTON]
S1012  TX16S_BUTTON  [TX16S_BUTTON]
S1013  TX16S_BUTTON2B  [TX16S_BUTTON2]
S1014  TX16S_BUTTON2A  [TX16S_BUTTON2]
TP1  TPSQTP11R  [TP11R]
TP100  TPSQTP11R  [TP11R]
TP101  TPSQTP10R  [TP10R]
TP102  TPSQTP10R  [TP10R]
TP103  TPSQTP10R  [TP10R]
TP104  TPSQTP10R  [TP10R]
TP105  TPSQTP10R  [TP10R]
TP113  TPSQTP10R  [TP10R]
TP115  TPSQTP11R  [TP11R]
TP116  TPSQTP11R  [TP11R]
TP1000  TPSQTP11R  [TP11R]
TP1001  TPSQTP11R  [TP11R]
TP1002  TPSQTP11R  [TP11R]
TP1003  TPSQTP11R  [TP11R]
TP1004  TPSQTP15R  [TP15R]
VR1000  10K  EVUF2L  [EVUFXL]
VR1001  10K  EVUF2L  [EVUFXL]
VR1002  10K  EVUF2L  [EVUFXL]
VR1003  10K  EVUF2L  [EVUFXL]
X1  KLBR4  [KLBR4]
Y100  32.768 kHz  CRYSTAL_3215  [3215]
Y101  12 MHz  CRYSTAL_SHIELD  [3225]

## Nets
5V: D1.A J12.11(5V) J12.13(5V)
6POS: C207.1 IC100.36(PC1) R117.2
6PS1: IC1.12(P1.1) S13.2.1 S13.2.2
6PS2: IC1.13(P1.0) S14.2.1 S14.2.2
6PS3: IC1.14(P0.7) S15.2.1 S15.2.2
6PS4: IC1.15(P0.6) S16.2.1 S16.2.2
6PS5: IC1.16(P0.5) S17.2.1 S17.2.2
6PS6: IC1.17(P0.4) S18.2.1 S18.2.2
!CHG_CTR: IC4.16(!STAT) IC100.180(PG11) R36.2 R227.1
!RST: C341.1 IC100.34(!RST) J12.10(!RESET) R347.1
+5V: C102.1 C210.1 C348.1 C358.1 C416.1 C419.1 C420.1 C422.1 C424.1 C439.1 C440.1 C441.1 D1.C D2.C D104.C D901.C F100.1 IC2.3(IN) IC101.1(IN) IC110.1(IN) IC110.3(EN) J15.2 J16.5 J17.6 J102.1 L104.1 L109.2 L111.1 Q119.2(S) R307.1 R312.2 R403.2 R421.2
AUDIO_5V: C351.1 C430.1 IC104.2(OUT) IC104.4(OUT) L106.2
AUDIO_GND: A1.GND C211.2 C352.2 C402.2 C403.2 C431.2 C900.2 IC105.7(GND) L107.1 R32.1 R309.1
AUDIO_MUTE: IC100.56(PA7) R205.2
AUDIO_OUT: C383.1 IC100.53(PA4)
AUX1_PWR: IC100.151(PH13) R212.1
AUX1_RX: IC100.91(PB11) J904.4 R133.1
AUX1_TX: IC100.90(PB10) J904.3 R134.1
AUX2_EN: IC100.179(PG10) J17.5 R135.1
AUX2_IO: J17.4 R18.1
AUX2_PWR: IC100.61(PB0) R213.1
AUX2_RX: IC100.178(PG9) J17.2 R136.1
AUX2_TX: IC100.183(PG14) J17.3 R137.1
AUX_5V: F100.2 Q121.2(S) R408.2 R932.1
BACKLIGHT_A: C409.1 D113.C J108.2
BACKLIGHT_C: IC111.1(FB) J108.1 R110.2
BO_6POS_ANA: IC1.20(P0.1) J11.24 J100.24 R11.2 R117.1
BO_BTN_POWER: D100.C D101.C J11.42 J100.42 S19.2.1 S19.2.2
BO_KEY_MDL: C1006.1 IC100.207(PI6) J8.2 J11.6 J100.6 J1007.2 R1006.2 TP1003.TP
BO_KEY_PAGE<: C1000.1 IC100.8(PC13) J7.6 J11.31 J100.31 J1006.6 R1000.2
BO_KEY_PAGE>: C1001.1 IC100.13(PI11) J7.5 J11.16 J100.16 J1006.5 R1001.2
BO_KEY_RTN: C1004.1 IC100.205(PI4) J7.2 J11.4 J100.4 J1006.2 R1004.2
BO_KEY_SYS: C1002.1 IC100.208(PI7) J7.4 J11.7 J100.7 J1006.4 R1002.2
BO_KEY_TELE: C1003.1 IC100.206(PI5) J7.3 J11.5 J100.5 J1006.3 R1003.2
BO_LED_BLUE/BOOT1: IC100.63(PB2) J11.10 J100.10 R3.2 R300.2
BO_LED_GREEN: D107.C J11.30 J100.30 LED7.AG(GRN-A) R166.2
BO_LED_RED: IC100.54(PA5) J11.8 J100.8 R4.2
BO_LS_ANA: J10.2 J11.18 J100.18 J1009.2 R126.1 VR1001.2(S)
BO_ROLLER_A: ENC1000.A J8.5 J11.48 J100.48 J1007.5 R225.1 R303.1 TP1000.TP
BO_ROLLER_B: ENC1000.B J8.4 J11.47 J100.47 J1007.4 R226.1 R304.1 TP1001.TP
BO_ROLLER_PRESS: C1005.1 IC100.7(PI8) J8.3 J11.11 J100.11 J1007.3 R1005.2 TP1002.TP
BO_RS_ANA: J9.2 J11.43 J100.43 J1008.2 R127.1 VR1000.2(S)
BO_S1_ANA: J5.3 J11.23 J100.23 J1004.3 R115.1 VR1002.2(S)
BO_S2_ANA: J5.2 J11.25 J100.25 J1004.2 R116.1 VR1003.2(S)
BO_SWA_DOWN: J1.4 J11.51 J100.51 J1000.4 R151.1 S1000.1(O)
BO_SWA_UP: J1.2 J11.44 J100.44 J1000.2 R150.1 S1000.3(S)
BO_SWB_DOWN: J1.5 J11.50 J100.50 J1000.5 R153.1 S1001.1(O)
BO_SWB_UP: J1.3 J11.49 J100.49 J1000.3 R152.1 S1001.3(S)
BO_SWC_DOWN: J2.5 J11.46 J100.46 J1001.5 R155.1 S1002.1(O)
BO_SWC_UP: J2.4 J11.52 J100.52 J1001.4 R154.1 S1002.3(S)
BO_SWD_DOWN: J2.2 J11.59 J100.59 J1001.2 R157.1 S1003.1(O)
BO_SWD_UP: J2.3 J11.58 J100.58 J1001.3 R156.1 S1003.3(S)
BO_SWE_BACK: J3.2 J11.27 J100.27 J1002.2 R158.1 S1004.1(O)
BO_SWE_FRONT: J3.4 J11.9 J100.9 J1002.4 R159.1 S1004.3(S)
BO_SWF_FRONT: J3.3 J11.26 J100.26 J1002.3 R160.1 S1006.3(S)
BO_SWG_BACK: J4.2 J11.60 J100.60 J1003.2 R162.1 S1005.1(O)
BO_SWG_FRONT: J4.3 J11.56 J100.56 J1003.3 R161.1 S1005.3(S)
BO_SWH_FRONT: J4.4 J11.41 J100.41 J1003.4 R163.1 S1007.3(S)
BO_TRA_DET: D111.C J6.3 J11.1 J100.1 J1005.3 J1011.3
BO_TRAINER_SIG: J6.2 J11.17 J100.17 J1005.2 J1011.4 R132.1
BO_TRIM1_L: J11.13 J100.13 R139.1 S1.2.1 S1.2.2
BO_TRIM1_R: J11.12 J100.12 R138.1 S2.2.1 S2.2.2
BO_TRIM2_D: J11.21 J100.21 R141.1 S3.2.1 S3.2.2
BO_TRIM2_U: J11.22 J100.22 R140.1 S4.2.1 S4.2.2
BO_TRIM3_D: J11.19 J100.19 R143.1 S5.2.1 S5.2.2
BO_TRIM3_U: J11.20 J100.20 R142.1 S6.2.1 S6.2.2
BO_TRIM4_L: J11.3 J100.3 R145.1 S7.2.1 S7.2.2
BO_TRIM4_R: J11.2 J100.2 R144.1 S8.2.1 S8.2.2
BO_TRIM5_D: J11.57 J100.57 R147.1 S9.2.1 S9.2.2
BO_TRIM5_U: J11.45 J100.45 R146.1 S10.2.1 S10.2.2
BO_TRIM6_D: J11.54 J100.54 R149.1 S11.2.1 S11.2.2
BO_TRIM6_U: J11.53 J100.53 R148.1 S12.2.1 S12.2.2
BUSB_DM: J112.A7(D-) J112.B7(D-) R904.1
BUSB_DP: J112.A6(D+) J112.B6(D+) R903.1
BUSB_VBUS: C373.1 C435.1 D900.A D901.A IC4.1(IN) J112.VBUS1(VBUS) J112.VBUS2(VBUS) L1.2 R29.2 R214.1 R411.1 R902.1 TP113.TP
C2CK: IC1.4(!!RSTC2CK) J90.2
C2D: IC1.5(P2.0/C2D) J90.3
CHG_DETECT: C375.1 IC100.182(PG13) R33.2 R37.1
DFU_BOOT: IC100.197(BOOT0) R223.1 R231.2
EX1: C220.1 IC100.29(PF8) R129.2
EX2: C219.1 IC100.30(PF9) R128.2
EXTMOD_TX: IC100.144(PA10) R207.1
EXTMODPWR: IC100.153(PH15) R209.1
EXTMODTX: J13.10 J103.5 R131.2
EXTMODVBAT: F101.1 J103.3 J103.4
FLASH_!CS: IC100.154(PI0) IC114.1(!CS!)
FLASH_CLK: IC100.155(PI1) IC114.6(CLK)
FLASH_MISO: IC100.156(PI2) IC114.2(DO/IO1)
FLASH_MOSI: IC100.157(PI3) IC114.5(DI/IO0)
GND: BT100.- BT1000.1(JST-) C1.2 C2.2 C3.2 C6.2 C7.2 C9.2 C100.2 C101.2 C103.2 C104.2 C105.2 C106.2 C108.2 C204.2 C208.2 C209.2 C210.2 C215.2 C300.2 C301.2 C302.2 C303.2 C304.2 C305.2 C306.2 C307.2 C308.2 C309.2 C310.2 C311.2 C312.2 C313.2 C314.2 C315.2 C316.2 C317.2 C318.2 C319.2 C320.2 C321.2 C322.2 C323.2 C324.2 C325.2 C326.2 C327.2 C328.2 C329.2 C330.2 C331.2 C332.2 C333.2 C334.2 C335.2 C336.2 C337.2 C338.2 C339.2 C340.2 C341.2 C342.2 C343.2 C344.2 C345.2 C346.2 C348.2 C349.2 C350.2 C351.2 C353.2 C356.2 C357.2 C358.2 C362.2 C363.2 C372.2 C373.2 C375.2 C376.2 C377.2 C378.2 C379.2 C380.2 C381.2 C382.2 C390.2 C400.2 C401.2 C405.2 C407.2 C408.2 C409.2 C410.2 C411.2 C415.2 C416.2 C417.2 C418.2 C419.2 C420.2 C422.2 C423.2 C424.2 C425.2 C427.2 C428.2 C429.2 C430.2 C435.2 C437.2 C438.2 C439.2 C440.2 C441.2 C442.2 C443.2 C444.2 C445.- C1000.2 C1001.2 C1002.2 C1003.2 C1004.2 C1005.2 C1006.2 D110.A D115.P$1 D116.P$1 D117.P$1 D118.P$1 D119.P$1 D120.P$1 D121.P$1 D122.P$1 D123.P$1 D124.P$1 D902.P$1 D903.P$1 ENC1000.C ENC1000.P$1 ENC1000.P$2 IC1.2(GND) IC1.EXP(GND) IC1.M(GND) IC2.1(GND) IC4.6(AGND) IC4.13(PGND) IC5.4(SDO/SA0) IC5.12(GND) IC5.13(GND) IC100.14(VSS) IC100.25(VSS) IC100.51(VSS) IC100.60(VSS) IC100.72(VSS) IC100.82(VSS) IC100.93(VSS) IC100.114(VSS) IC100.125(VSS) IC100.136(VSS) IC100.149(VSS) IC100.170(VSS) IC100.184(VSS) IC100.202(VSS) IC101.2(GND) IC103.5(GND) IC103.PAD(PWPD) IC104.1(GND) IC106.3(GND) IC107.3(GND) IC108.3(GND) IC110.2(GND) IC110.4(N/C) IC111.3(GND) IC111.PAD IC114.4(GND) IC116.6(VSSQ) IC116.12(VSSQ) IC116.28(VSS) IC116.41(VSS) IC116.46(VSSQ) IC116.52(VSSQ) IC116.54(VSS) J1.1 J1.G1 J1.G2 J2.1 J2.G1 J2.G2 J3.1 J3.5 J3.G1 J3.G2 J4.1 J4.5 J4.G1 J4.G2 J5.G1 J5.G2 J6.1 J6.G1 J6.G2 J7.1 J7.G1 J7.G2 J8.1 J8.6 J8.G1 J8.G2 J9.G1 J9.G2 J10.G1 J10.G2 J11.38 J11.39 J11.40 J11.G1 J11.G2 J12.3(GND(X5)) J12.5(GND(X5)) J12.15(GND(X5)) J12.17(GND(X5)) J12.19(GND(X5)) J13.1 J13.2 J14.1 J15.1 J16.1 J17.1 J90.1 J100.38 J100.39 J100.40 J100.G1 J100.G2 J106.5 J107.5 J108.G1 J108.G2 J109.1 J109.G1 J109.G2 J112.G1(SHLD) J112.G2(SHLD) J112.G3(SHLD) J112.G4(SHLD) J112.GND J112.GND2(GND) J113.1 J114.6(GND) J114.G1(SHIELD) J114.G2(SHIELD) J114.G3(SHIELD) J114.G4(SHIELD) J904.1 J1000.1 J1001.1 J1002.1 J1002.5 J1003.1 J1003.5 J1005.1 J1006.1 J1006.G1 J1006.G2 J1007.1 J1007.6 J1007.G1 J1007.G2 J1010.G1(SHLD) J1010.G2(SHLD) J1010.G3(SHLD) J1010.G4(SHLD) J1010.GND J1010.GND2(GND) J1011.2A J1011.2B J1012.1 L107.2 L108.2 L110.2 LED7.CB(BLU-C) LED7.CG(GRN-C) LED7.CR(RED-C) Q101.2(E) Q102.2(E) Q103.2(E) Q104.2(E) Q106.2(E) Q107.2(E) Q108.2(E) Q109.2(E) Q110.2(E) Q111.2(E) R5.1 R6.1 R7.1 R8.1 R9.1 R10.1 R11.1 R15.1 R16.1 R26.1 R27.1 R30.1 R36.1 R101.1 R110.1 R228.1 R229.1 R231.1 R300.1 R301.1 R306.1 R311.1 R313.1 R315.1 R317.1 R320.1 R324.1 R328.1 R331.1 R332.1 R350.1 R352.1 R353.1 R401.1 R405.1 R406.1 R1007.1 R1008.1 RT1.P$1 S1.1.1 S1.1.2 S2.1.1 S2.1.2 S3.1.1 S3.1.2 S4.1.1 S4.1.2 S5.1.1 S5.1.2 S6.1.1 S6.1.2 S7.1.1 S7.1.2 S8.1.1 S8.1.2 S9.1.1 S9.1.2 S10.1.1 S10.1.2 S11.1.1 S11.1.2 S12.1.1 S12.1.2 S13.1.1 S13.1.2 S14.1.1 S14.1.2 S15.1.1 S15.1.2 S16.1.1 S16.1.2 S17.1.1 S17.1.2 S18.1.1 S18.1.2 S19.1.1 S19.1.2 S20.SH1(SH) S20.SH2(SH) S1000.2(P) S1001.2(P) S1002.2(P) S1003.2(P) S1004.2(P) S1005.2(P) S1006.2(P) S1007.2(P) S1008.1.1 S1008.1.2 S1009.1.1 S1009.1.2 S1010.1.1 S1010.1.2 S1011.1.1 S1011.1.2 S1012.1.1 S1012.1.2 S1013.2.1(1.1) S1013.2.2(1.2) S1013.SH S1014.1.1 S1014.1.2 S1014.SH TP1004.TP Y101.2 Y101.4
GND_LCD: C360.2 C361.2 C414.2 J108.3 J108.29 J108.36 R101.2
GNDA: C107.2 C200.2 C201.2 C202.2 C203.2 C205.2 C206.2 C207.2 C212.2 C213.2 C214.2 C216.2 C217.2 C218.2 C219.2 C220.2 C354.2 C355.2 C404.2 C412.2 C413.2 C421.2 C901.2 C902.2 IC100.40(VSSA) IC102.2(GND) IC109.2(GND) IC109.4(N/C) J5.4 J5.5 J9.1 J10.1 J11.34 J11.35 J100.34 J100.35 J104.3 J104.6 J105.3 J105.6 J106.1 J107.1 J1004.4 J1004.5 J1008.1 J1009.1 L110.1 VR1000.1(A) VR1001.1(A) VR1002.3(E) VR1003.3(E)
HAPTIC: R17.1 R167.1
HEARTBEAT: D103.C J103.6
I2C1_SCL: IC5.2(SCL) IC100.198(PB8) J16.2 J109.2 R220.1 TP101.TP
I2C1_SDA: IC5.3(SDA) IC100.199(PB9) J16.4 J109.3 R219.1 TP102.TP
INTMOD_5V: J103.1 J103.12 Q119.3(D)
INTMOD_BOOT: J103.8 Q106.3(C)
INTMOD_RX: IC100.196(PB7) R119.1
INTMOD_TX: IC100.195(PB6) R120.1
INTMODBOOT: IC100.11(PI9) R210.1
INTMODPWR: IC100.142(PA8) J100.55 R208.1
LCD_!RST: IC100.12(PI10) RN104.2A
LCD_B3: IC100.177(PJ15) RN102.4A
LCD_B4: IC100.186(PK3) RN103.1A
LCD_B5: IC100.187(PK4) RN103.2A
LCD_B6: IC100.188(PK5) RN103.3A
LCD_B7: IC100.189(PK6) RN103.4A
LCD_BACKLIGHT: IC100.62(PB1) L102.2
LCD_CLK: IC100.21(PI14) L103.2
LCD_DE: IC100.190(PK7) R130.1
LCD_G2: IC100.121(PJ9) RN101.2A
LCD_G3: IC100.122(PJ10) RN101.3A
LCD_G4: IC100.123(PJ11) RN101.4A
LCD_G5: IC100.126(PK0) RN102.1A
LCD_G6: IC100.127(PK1) RN102.2A
LCD_G7: IC100.128(PK2) RN102.3A
LCD_HSYNC: IC100.19(PI12) RN104.3A
LCD_R3: IC100.67(PJ2) RN100.1A
LCD_R4: IC100.68(PJ3) RN100.2A
LCD_R5: IC100.69(PJ4) RN100.3A
LCD_R6: IC100.95(PJ5) RN100.4A
LCD_R7: IC100.118(PJ6) RN101.1A
LCD_VSYNC: IC100.20(PI13) RN104.4A
LEDPOS1: IC1.6(P1.7) LED1.A
LEDPOS2: IC1.7(P1.6) LED2.A
LEDPOS3: IC1.8(P1.5) LED3.A
LEDPOS4: IC1.9(P1.4) LED4.A
LEDPOS5: IC1.10(P1.3) LED5.A
LEDPOS6: IC1.11(P1.2) LED6.A
N$1: IC116.38(CLK) R103.2
N$2: C407.1 IC100.92(VCAP1)
N$3: Q1.3(C) R319.2 R332.2
N$4: D113.A IC111.4(SW) L114.2
N$5: IC100.98(PH8) R166.1
N$6: Q1.1(B) R318.2 R333.1
N$11: C382.1 IC111.2(COMP)
N$12: IC107.4(O) IC108.2(I)
N$13: IC108.4(O) R118.2
N$14: IC106.2(I) R206.2
N$15: IC114.3(!WP!/IO2) R344.1
N$16: IC114.7(!HOLD!/IO3) R345.1
N$22: C1.1 IC1.1(P0.0)
N$23: J103.2 J103.11 L108.1
N$24: J103.9 R120.2
N$27: LED1.C R10.2
N$28: LED2.C R9.2
N$29: LED4.C R7.2
N$30: LED3.C R8.2
N$31: LED5.C R6.2
N$32: R1004.1 S1012.2.1 S1012.2.2
N$33: R1003.1 S1011.2.1 S1011.2.2
N$34: LED6.C R5.2
N$35: R1002.1 S1010.2.1 S1010.2.2
N$36: Q119.1(G) R314.2 R403.1
N$37: Q2.4(S) R31.2 R407.2 R932.2
N$38: F1.2 Q2.1(D) Q2.2(D) Q2.5(D) Q2.6(D)
N$39: A1.L A1.R R32.2 R38.2
N$40: J112.A5(CC1) R229.2
N$41: J1010.B5(CC2) R1007.2
N$42: J1010.A5(CC1) R1008.2
N$43: R1001.1 S1009.2.1 S1009.2.2
N$44: R1000.1 S1008.2.1 S1008.2.2
N$45: R1006.1 S1014.2.1 S1014.2.2
N$46: R1005.1 S1013.1.1(2.1) S1013.1.2(2.2)
N$47: LED7.AB(BLU-A) R3.1
N$48: J112.B5(CC2) R228.2
N$49: LED7.AR(RED-A) R4.1
N$57: C405.1 C425.1 IC111.6(VIN) L111.2 L114.1
N$60: IC101.3(EN) R307.2
N$62: Q103.3(C) R314.1
N$63: Q103.1(B) R208.2 R315.2
N$65: D104.A J102.2 Q109.3(C)
N$66: IC111.5(CTRL) R211.2 R406.2
N$67: L102.1 R211.1
N$68: Q109.1(B) R167.2 R324.2
N$69: C346.1 Q101.1(B) R204.2 R306.2
N$70: D101.A Q101.3(C) R305.1
N$71: D107.A Q117.3(C)
N$72: Q117.1(B) R227.2 R411.2
N$73: C350.1 C417.1 IC104.3(IN) L105.1
N$74: Q117.2(E) R214.2
N$76: Q128.3(G) R316.2 R404.1
N$84: C410.1 IC100.148(VCAP2)
N$86: Q104.1(B) R209.2 R317.2
N$87: Q104.3(C) R316.1
N$88: C418.1 D110.C F101.2 Q128.1(D) Q128.2(D) Q128.5(D) Q128.6(D)
N$89: J103.10 R119.2
N$90: Q102.3(C) R131.1 R312.1
N$91: Q106.1(B) R210.2 R320.2
N$92: D103.A R318.1
N$93: Q102.1(B) R207.2 R313.2
N$94: F1.1 J13.4
N$95: J13.6 R134.2
N$96: J13.8 R133.2
N$97: J13.3 J14.4 Q121.3(D)
N$98: Q121.1(G) R330.2 R408.1
N$99: C208.1 IC101.4(BP)
N$100: Q2.3(G) R327.2 R407.1
N$101: Q110.3(C) R327.1
N$102: Q110.1(B) R212.2 R328.2
N$104: Q111.3(C) R330.1
N$105: D122.P$2 J114.8(D1) R107.1
N$106: Q111.1(B) R213.2 R331.2
N$107: J13.5 J14.3 R137.2
N$108: J13.7 J14.2 R136.2
N$109: J13.9 R135.2
N$111: R24.1 R223.2 S20.1
N$112: L103.1 RN104.1A
N$113: J105.1 R125.1
N$114: J104.1 R123.1
N$115: J105.4 R124.1
N$116: J107.2 R129.1
N$117: C355.1 C404.1 C421.1 IC102.1(IN) IC109.1(IN) IC109.3(EN) L109.1 R325.1
N$118: J104.4 R122.1
N$119: J106.4 R164.1
N$120: J107.4 R165.1
N$121: Q108.1(B) R218.2
N$122: J106.2 R128.1
N$123: C212.1 IC102.4(BP)
N$124: IC102.3(EN) R325.2
N$126: A1.+5V C211.1 C352.1 C402.1 C431.1 IC105.6(VDD) L106.1
N$127: D111.A Q107.1(B) R321.1
N$128: IC105.4(-IN) R348.2 R349.1
N$129: C383.2 R348.1
N$130: IC105.1(SD) R205.1 R309.2 R900.1
N$131: C403.1 IC105.2(BYP) R102.2
N$132: C900.1 IC105.3(+IN) R102.1
N$133: C215.1 R121.1 R352.2 R422.1
N$134: Q127.3(G) R305.2 R402.1
N$135: Q126.3(G) R401.2 R425.1
N$136: C345.1 C444.1 Q126.4(S) Q127.4(S) R402.2 R425.2
N$137: R25.1 X1.S
N$138: IC103.1(EN) R308.1
N$140: C347.2 IC103.6(SW) L104.2
N$141: C204.1 IC103.4(SS)
N$142: C347.1 IC103.7(VBST)
N$143: C102.2 IC103.2(VFB) R350.2 R421.1
N$144: D121.P$2 J114.7(D0) R108.1
N$146: J101.1 X1.B
N$147: D120.P$2 D902.P$2 D903.P$2 J114.5(CLK) R114.1
N$148: D119.P$2 J114.3(CMD) R109.1
N$149: D124.P$2 J114.2(D3) R105.1
N$150: D123.P$2 J114.1(D2) R106.1
N$151: C100.1 IC100.9(PC14) Y100.1
N$152: C101.1 IC100.10(PC15) Y100.2
N$153: C103.1 IC100.33(PH1) Y101.3
N$155: C104.1 IC100.32(PH0) Y101.1
N$159: IC4.5(ISET) R26.2
N$160: IC4.17(CV) R27.2
N$161: IC4.9(MID) R28.1
N$162: C8.2 IC4.2(SW) IC4.12(SW) L1.1
N$164: IC4.7(VLIM) R29.1 R30.2
N$166: IC4.18(!ACOK) R33.1
N$169: IC4.8(NTC) R34.1 R35.2
N$170: R35.1 RT1.P$2
N$171: C8.1 IC4.3(BST)
PDR_ON: IC100.203(PDR_ON) R100.1
POT1: C205.1 IC100.35(PC0) R115.2
POT2: C206.1 IC100.37(PC2) R116.2
PWR_ON: IC100.66(PJ1) R204.1
RAM_!CAS: IC100.191(PG15) IC116.17(!CAS)
RAM_!CS: IC100.96(PH6) IC116.19(!CS)
RAM_!RAS: IC100.70(PF11) IC116.18(!RAS)
RAM_!WE: IC100.49(PH5) IC116.16(!WE)
RAM_A0: IC100.16(PF0) IC116.23(A0)
RAM_A1: IC100.17(PF1) IC116.24(A1)
RAM_A2: IC100.18(PF2) IC116.25(A2)
RAM_A3: IC100.22(PF3) IC116.26(A3)
RAM_A4: IC100.23(PF4) IC116.29(A4)
RAM_A5: IC100.24(PF5) IC116.30(A5)
RAM_A6: IC100.71(PF12) IC116.31(A6)
RAM_A7: IC100.74(PF13) IC116.32(A7)
RAM_A8: IC100.75(PF14) IC116.33(A8)
RAM_A9: IC100.76(PF15) IC116.34(A9)
RAM_A10: IC100.77(PG0) IC116.22(A10/AP)
RAM_A11: IC100.78(PG1) IC116.35(A11)
RAM_BS0: IC100.131(PG4) IC116.20(BS0)
RAM_BS1: IC100.132(PG5) IC116.21(BS1)
RAM_CKE: IC100.194(PB5) IC116.37(CKE)
RAM_CLK: IC100.135(PG8) R103.1
RAM_D0: IC100.116(PD14) IC116.2(DQ0)
RAM_D1: IC100.117(PD15) IC116.4(DQ1)
RAM_D2: IC100.164(PD0) IC116.5(DQ2)
RAM_D3: IC100.165(PD1) IC116.7(DQ3)
RAM_D4: IC100.79(PE7) IC116.8(DQ4)
RAM_D5: IC100.80(PE8) IC116.10(DQ5)
RAM_D6: IC100.81(PE9) IC116.11(DQ6)
RAM_D7: IC100.84(PE10) IC116.13(DQ7)
RAM_D8: IC100.85(PE11) IC116.42(DQ8)
RAM_D9: IC100.86(PE12) IC116.44(DQ9)
RAM_D10: IC100.87(PE13) IC116.45(DQ10)
RAM_D11: IC100.88(PE14) IC116.47(DQ11)
RAM_D12: IC100.89(PE15) IC116.48(DQ12)
RAM_D13: IC100.108(PD8) IC116.50(DQ13)
RAM_D14: IC100.109(PD9) IC116.51(DQ14)
RAM_D15: IC100.110(PD10) IC116.53(DQ15)
RAM_NBL0: IC100.200(PE0) IC116.15(LDQM)
RAM_NBL1: IC100.201(PE1) IC116.39(UDQM)
RF_HB: IC100.112(PD12) R319.1
ROTENC_A: IC100.101(PH11) R225.2
ROTENC_B: IC100.100(PH10) R226.2
S.PORT: J103.7 R118.1 R206.1
S.PORT_DIR: IC100.168(PD4) IC108.1(OE) R311.2
S.PORT_RX: IC100.172(PD6) IC106.4(O) R310.1
S.PORT_TX: IC100.169(PD5) IC107.2(I)
S_PWR: C344.1 D100.A IC100.65(PJ0) R224.1 R353.2
SA_D: C313.1 IC100.99(PH9) R151.2
SA_U: C312.1 IC100.64(PI15) R150.2
SB_D: C315.1 IC100.104(PB12) R153.2
SB_U: C314.1 IC100.102(PH12) R152.2
SC_D: C317.1 IC100.111(PD11) R155.2
SC_U: C316.1 IC100.107(PB15) R154.2
SD_CK: IC100.163(PC12) R114.2
SD_CMD: IC100.166(PD2) R109.2
SD_D: C319.1 IC100.129(PG2) R157.2
SD_D0: IC100.140(PC8) R108.2
SD_D1: IC100.141(PC9) R107.2
SD_D2: IC100.161(PC10) R106.2
SD_D3: IC100.162(PC11) R105.2
SD_PRESENT: C381.1 D118.P$2 IC100.58(PC5) J114.CD(CDETECT) R346.1
SD_U: C318.1 IC100.119(PJ7) R156.2
SE_B: C320.1 IC100.48(PH4) R158.2
SE_F: C321.1 IC100.97(PH7) R159.2
SF_F: C322.1 IC100.47(PH3) R160.2
SG_B: C324.1 IC100.130(PG3) R162.2
SG_F: C323.1 IC100.133(PG6) R161.2
SH_F: C325.1 IC100.134(PG7) R163.2
SI: C357.1 IC100.152(PH14) R165.2
SJ: C356.1 R12.1 R164.2
SLIDER1: C217.1 IC100.27(PF6) R126.2
SLIDER2: C218.1 IC100.38(PC3) R127.2
SPEAKER_BLACK: IC105.5(VO1) J101.2 R25.2 R38.1 R349.2
SPEAKER_RED: IC105.8(VO2) X1.R X1.T
STICK_LH: C200.1 IC100.43(PA0) R123.2
STICK_LV: C201.1 IC100.44(PA1) R122.2
STICK_RH: C202.1 IC100.45(PA2) R125.2
STICK_RV: C203.1 IC100.50(PA3) R124.2
SUPPLY_BATT: F102.2 Q126.1(D) Q126.2(D) Q126.5(D) Q126.6(D)
SUPPLY_VBAT: C408.1 C437.1 C438.1 IC103.8(VIN) L105.2 Q127.1(D) Q127.2(D) Q127.5(D) Q127.6(D) Q128.4(S) R31.1 R308.2 R404.2 R422.2
SWCLK: IC100.159(PA14) J12.4(SWCLK)
SWDIO: IC100.147(PA13) J12.2(SWDIO)
SWO/ESP32BOOT: IC100.192(PB3) J12.6(SWO) R18.2
SYS: C6.1 IC4.11(SYS)
T1_L: C301.1 IC100.167(PD3) R139.2
T1_R: C300.1 IC100.173(PD7) R138.2
T2_D: C303.1 IC100.175(PJ13) R141.2
T2_U: C302.1 IC100.174(PJ12) R140.2
T3_D: C305.1 IC100.181(PG12) R143.2
T3_U: C304.1 IC100.176(PJ14) R142.2
T4_L: C307.1 IC100.55(PA6) R145.2
T4_R: C306.1 IC100.57(PC4) R144.2
T5_D: C309.1 IC100.120(PJ8) R147.2
T5_U: C308.1 IC100.113(PD13) R146.2
T6_D: C311.1 IC100.105(PB13) R149.2
T6_U: C310.1 IC100.106(PB14) R148.2
TDI: IC100.160(PA15) J12.8(TDI) R301.2
TFT_!RST: C361.1 J108.31 RN104.2B
TFT_B3: J108.24 RN102.4B
TFT_B4: J108.25 RN103.1B
TFT_B5: J108.21 J108.26 RN103.2B
TFT_B6: J108.22 J108.27 RN103.3B
TFT_B7: J108.23 J108.28 RN103.4B
TFT_CLK: J108.30 RN104.1B
TFT_DE: J108.34 R130.2
TFT_G2: J108.15 RN101.2B
TFT_G3: J108.16 RN101.3B
TFT_G4: J108.17 RN101.4B
TFT_G5: J108.18 RN102.1B
TFT_G6: J108.13 J108.19 RN102.2B
TFT_G7: J108.14 J108.20 RN102.3B
TFT_HSYNC: J108.32 RN104.3B
TFT_R3: J108.8 RN100.1B
TFT_R4: J108.9 RN100.2B
TFT_R5: J108.5 J108.10 RN100.3B
TFT_R6: J108.6 J108.11 RN100.4B
TFT_R7: J108.7 J108.12 RN101.1B
TFT_VSYNC: J108.33 RN104.4B
TOUCH_3V3: IC2.2(OUT) L101.2
TOUCH_INT: IC100.46(PH2) J109.4 R901.1 TP103.TP
TOUCH_RST: IC100.31(PF10) J109.5 R326.1 TP104.TP
TOUCH_VDD: C362.1 C415.1 J16.3 J109.6 L101.1 TP105.TP
TRA_DETECT: IC100.193(PB4) Q107.3(C) R322.1
TRACECLK: IC100.1(PE2) J12.12(TRACECLK)
TRACED0/SJ: IC100.2(PE3) J12.14(TRACEDATA0) R12.2
TRACED1/PREV1: IC100.3(PE4) J12.16(TRACEDATA1) R13.2 R15.2
TRACED2/PREV2: IC100.4(PE5) J12.18(TRACEDATA2) R14.2 R16.2
TRACED3/HAPTIC: IC100.5(PE6) J12.20(TRACEDATA3) R17.2
TRAINER_IN: IC100.138(PC6) Q108.3(C) R323.1
TRAINER_OUT: C106.1 D112.A IC100.139(PC7) R132.2 R218.1 R405.2
TUSB_DM: J6.5 J1005.5 J1010.A7(D-) J1010.B7(D-) R1.1
TUSB_DP: J6.4 J1005.4 J1010.A6(D+) J1010.B6(D+) R2.1
USB_D+: IC100.146(PA12) J11.14 J100.14 R2.2 R903.2
USB_D-: IC100.145(PA11) J11.15 J100.15 R1.2 R904.2
USB_VBUS: C105.1 C342.1 D2.A IC100.143(PA9) J6.6 J11.28 J100.28 J1005.6 J1010.VBUS1(VBUS) J1010.VBUS2(VBUS) R24.2 R902.2 S20.2
VBAT+: BT1000.3(JST_2S) C442.1 C443.1 D900.C F102.1 IC4.10(BATT) J113.3 J1012.3 TP116.TP
VBAT_3V: BT100.+ C343.1 C400.1 IC100.6(VBAT)
VBAT_MID: BT1000.2(JST_1S) J113.2 J1012.2 R28.2 TP115.TP
VBATT: C216.1 IC100.28(PF7) R121.2
VCC: C7.1 IC4.4(VCC) R34.2
VDD_LCD: C360.1 C414.1 IC110.5(OUT) J108.4
VDD_MCU: C2.1 C3.1 C9.1 C108.1 C209.1 C326.1 C327.1 C328.1 C329.1 C330.1 C331.1 C332.1 C333.1 C334.1 C335.1 C336.1 C337.1 C338.1 C339.1 C340.1 C349.1 C353.1 C363.1 C372.1 C376.1 C377.1 C378.1 C379.1 C390.1 C411.1 C427.1 C428.1 C429.1 C445.+ D112.C IC1.3(VDD) IC5.1(VDDIO) IC5.5(CS) IC5.16(VDD) IC100.15(VDD) IC100.26(VDD) IC100.39(VDD) IC100.52(VDD) IC100.59(VDD) IC100.73(VDD) IC100.83(VDD) IC100.94(VDD) IC100.103(VDD) IC100.115(VDD) IC100.124(VDD) IC100.137(VDD) IC100.150(VDD) IC100.158(VDD) IC100.171(VDD) IC100.185(VDD) IC100.204(VDD) IC101.5(OUT) IC106.5(VCC) IC107.5(VCC) IC108.5(VCC) IC114.8(VCC) IC116.1(VDD) IC116.3(VDDQ) IC116.9(VDDQ) IC116.14(VDD) IC116.27(VDD) IC116.43(VDDQ) IC116.49(VDDQ) J11.32 J11.33 J12.1(VTREF) J100.32 J100.33 J904.2 Q1.2(E) R13.1 R14.1 R37.2 R100.2 R104.2 R219.2 R220.2 R224.2 R303.2 R304.2 R310.2 R321.2 R322.2 R323.2 R326.2 R333.2 R344.2 R345.2 R346.2 R347.2 R900.2 R901.2 TP1.TP TP100.TP
VDD_SDCARD: C380.1 C423.1 D117.P$2 J114.4(VDD) R104.1
VDDA: C107.1 C213.1 C354.1 C412.1 IC100.42(VDDA) IC102.5(OUT)
VREF+: C214.1 C413.1 C901.1 C902.1 D115.P$2 D116.P$2 IC100.41(VREF+) IC109.5(OUT) J5.1 J9.3 J10.3 J11.36 J11.37 J100.36 J100.37 J104.2 J104.5 J105.2 J105.5 J106.3 J107.3 J1004.1 J1008.3 J1009.3 VR1000.3(E) VR1001.3(E) VR1002.1(A) VR1003.1(A)
VREG5: C401.1 IC103.3(VREG5)
Unconnected: IC1.18(P0.3) IC1.19(P0.2) IC4.14(SCL) IC4.15(SDA) IC5.6(INT2) IC5.7(INT1) IC5.8(RES) IC5.9(RES) IC5.10(RES) IC5.11(RES) IC5.15(RES) IC116.36(NC) IC116.40(NC) J11.29 J11.55 J12.9(NC) J100.29 J108.35 J108.37 J108.38 J108.39 J108.40 J112.A8(SBU1) J112.B8(SBU2) J1010.A8(SBU1) J1010.B8(SBU2) J1011.5A J1011.5B S1006.1(O) S1007.1(O)

## Notes on the sheet
- Breakout board connectors | Breakout board
- Mainboard (enhanced)
- Trims
- Switches | Switches | Connector to mainboard | Connector to breakout board | Switches | Power ON/OFF
- Main microcontroller
- BLUE | Internal & external RF module connections | LCD & touchscreen | Main battery charger and balancer
- YELLOW
- SA short | SB long | RED | LCD power and backlight dimmer
- WHITE | AB | S.PORT Telemetry | Connector
- BLACK | Lithium battery charge and balance controller
- BLUE
- YELLOW | DFU
- SC long | SD short | RED
- WHITE | CD
- BLACK
- INT & EXT module
- BLUE
- YELLOW
- SE short | SF long | RED
- WHITE | EF
- BLACK
- NC
- External module TX (PPM/SBUS) | Internal module power (5V)
- Main 5V supply
- BLUE
- YELLOW
- SG short | SH long | RED
- WHITE | HG
- BLACK | Bottom USB-C
- Top USB-C and trainer | Top USB-C and trainer | LCD
- GREEN
- Regulator point 0.765V
  (Output 4.94V)
- BLUE
- YELLOW
- RED | USB
- WHITE
- Top USB-C | BLACK | NC
- External module power (VBAT) | RF module heartbeat
- Optional (not populated)
- Main 3.3V supply
- 3.5mm TRRS jack | Battery terminal
- TFT LCD 480x272 4.3"
- Keys and roller | Keys, roller, power button and RGB-LED | 6-Position switch & LEDs
- Trims | Internal module boot
- NC
- Buttons left
- NC
- NC
- Li 2Cell
  BATTERY
- NC
- Arm Cortex Debug & Trace | Populate for normal/non-HW trace | NC
- Trainer | Haptic | Touchscreen
- I2C port | Memory (ext. RAM, Flash, SD card)
- SDRAM | FLASH (not used by OpenTX currently)
- HAPTIC
- Touchscreen
- C2-Debug
- Power button
- Analog (supply & analog inputs)
- Serial I/O (AUX1-2, WiFi/BT, GPS)
- Analog voltage reference and supply | Battery voltage
- USART3 / AUX1
- USART6 / AUX2 / BT / GPS
- USART6 internal header
  (e.g. for WiFi/Bluetooth)
- Roller | Power button | IMU
- Factor: 0.245
  (max 3.3V output is reached with 13.45V)
- Pots
- Roller & MDL key | DEBUG-SERIAL | USART6 header
- Internal GPS
- MicroSD card
- Sticks | Sliders | Optional EX1-2 & SI, SJ
- Pots & Sliders | Pots & Sliders | Extra (Fiducials)
- Audio out
- RED | STICK-L
- WHITE | EX2 & SJ
- BLACK | RS
- AUX1 (top row) & AUX2 (bottom)
- Try 62K
- RED
- WHITE
- BLACK | LS
- Extra (Fiducials)
- SPEAKER
- STICK-R
- EX1 & SI
- BLUE
- YELLOW
- RED
- WHITE | VR
- BLACK
- S1 | S2
- HEADPHONES

## Library data of the parts
A1 = added_parts:BT_KN330
BT100 = battery:CH291-1220LF: Battery Holder, SMT, 12mm multicomp PART NO. CH291-1220LF Source: Data sheet <http://www.farnell.com/datasheets/1505860.pdf>
BT1000 = added_parts:LIBATT_2S_5000
C1-C3 C6-C9 C100-C108 C200-C220 C300-C358 C360-C363 C372 C373 C375-C383 C390 C400-C405 C407-C425 C427-C431 C435 C437-C444 C900-C902 C1000-C1006 = rcl:C-EU: CAPACITOR, European symbol
C445 = rcl:CPOL-EU: POLARIZED CAPACITOR, European symbol
D1 D110-D112 = diode:DIODE-: DIODE
D2 D113 D900 = added_parts:SS34
D100 D101 D104 D901 = added_parts:1N4148
D103 D107 = added_parts:1SS389
D115-D124 D902 D903 = added_parts:TVS-BIDIR
ENC1000 = added_parts:ALPS_EC10E
F1 F100-F102 = added_parts:FUSE
FD1 FD2 FD100-FD107 = added_parts:FIDUCIAL
IC1 = silabs:C8051F330*: 8kB ILP Flash MCU Family Source: www.silabs.com .. C8051F33x.pdf; MPN: C8051F330-GM; OC_FARNELL: 1291513; OC_NEWARK: 24M1242
IC2 = added_parts:XC6202P
IC4 = added_parts:MP2672A
IC5 = added_parts:LSM6DS33
IC100 = added_parts:STM32F42X: STM32F42X The STM32F429/439 have Cortex-M4 core (with floating point unit), run up to 180 MHz, provide from 512-Kbyte Flash to 2-Mbyte dual-bank Flash and 256-Kbyte SRAM.
IC101 IC102 = added_parts:SGM2028
IC103 = added_parts:TPS54228
IC104 = added_parts:AMS1117
IC105 = added_parts:8002A
IC106 IC107 = 74xx-little-de:74*1G04: INVERTER Gate
IC108 = 74xx-little-de:74*1G126: Single Bus Buffer Gate With 3-State Outputs
IC109 IC110 = added_parts:TLV700
IC111 = added_parts:TPS61161
IC114 = added_parts:GD25Q127C
IC116 = added_parts:W9864G6KH: W9864G6KH High-speed synchronous dynamic random access memory (SDRAM), organized as 1M words x 4 banks x 16 bits.
J1-J5 = added_parts:AT_1SH-A-05-XS
J6 = added_parts:AT_1SH_A_06-XS
J7 J8 = added_parts:AT_1SH-A-06-XR
J9 J10 = added_parts:AT_1SH-A-03-XS
J11 = added_parts:CON-FFC-60-REV
J12 = added_parts:CORTEX_DEBUG_TRACE
J13 = added_parts:PH2.54-5W2
J14 = added_parts:MOLEX_53047-04
J15 J101 J102 = added_parts:MOLEX_53047-02
J16 J106 J107 = added_parts:MOLEX_53047-05
J17 J104 J105 = added_parts:MOLEX_53047-06
J90 = added_parts:JST_B3B-PH-K-S
J100 = added_parts:CON-FFC-60
J103 = added_parts:MOLEX_53047-12
J108 = added_parts:CON-FFC-40
J109 = added_parts:CON-FFC-6-REV
J112 J1010 = added_parts:USB-C-16
J113 = added_parts:JST_B3B-XH-A
J114 = added_parts:TFWF1
J904 = added_parts:JST_B4B-PH-K-S
J1000-J1004 = added_parts:CON5F
J1005 = added_parts:CON6F
J1006 J1007 = added_parts:AT_1SH-A-06-XR-REVORDER
J1008 J1009 = added_parts:CON3F
J1011 = added_parts:PJ-313B
J1012 = added_parts:JST_XHP-3
L1 L104-L107 L114 = rcl:L-EU: INDUCTOR, European symbol
L101-L103 L108-L111 = added_parts:L
LED1-LED6 = led:LED: LED OSRAM: - CHIPLED LG R971, LG N971, LY N971, LG Q971, LY Q971, LO R971, LY R971 LH N974, LH R974 LS Q976, LO Q976, LY Q976 LO Q996 - Hyper CHIPLED LW Q18S LB Q993, LB Q99A, LB R99A - SideLED LS A670, LO A670, LY A670, LG A670, LP A670 LB A673, LV A673, LT A673, LW A673 LH A674 LY A675 LS A676, LA A676, LO A676, LY A676, LW A676 LS A679, LY A679, LG A679 - Hyper Micro SIDELED® LS Y876, LA Y876, LO Y876, LY Y876 LT Y87S - SmartLED LW L88C, LW L88S LB L89C, LB L89S, LG L890 LS L89K, LO L89K, LY L89K LS L896, LA L896, LO L896, LY L896 - TOPLED LS T670, LO T670, LY T670, LG T670, LP T670 LSG T670, LSP T670, LSY T670, LOP T670, LYG T670 LG T671, LOG T671, LSG T671 LB T673, LV T673, LT T673, LW T673 LH T674 LS T676, LA T676, LO T676, LY T676, LB T676, LH T676, LSB T676, LW T676 LB T67C, LV T67C, LT T67C, LS T67K, LO T67K, LY T67K, LW E67C LS E67B, LA E67B, LO E67B, LY E67B, LB E67C, LV E67C, LT E67C LW T67C LS T679, LY T679, LG T679 LS T770, LO T770, LY T770, LG T770, LP T770 LB T773, LV T773, LT T773, LW T773 LH T774 LS E675, LA E675, LY E675, LS T675 LS T776, LA T776, LO T776, LY T776, LB T776 LHGB T686 LT T68C, LB T68C - Hyper Mini TOPLED® LB M676 - Mini TOPLED Santana® LG M470 LS M47K, LO M47K, LY M47K Source: http://www.osram.convergy.de LUXEON: - LUMILED® LXK2-PW12-R00, LXK2-PW12-S00, LXK2-PW14-U00, LXK2-PW14-V00 LXK2-PM12-R00, LXK2-PM12-S00, LXK2-PM14-U00 LXK2-PE12-Q00, LXK2-PE12-R00, LXK2-PE12-S00, LXK2-PE14-T00, LXK2-PE14-U00 LXK2-PB12-K00, LXK2-PB12-L00, LXK2-PB12-M00, LXK2-PB14-N00, LXK2-PB14-P00, LXK2-PB14-Q00 LXK2-PR12-L00, LXK2-PR12-M00, LXK2-PR14-Q00, LXK2-PR14-R00 LXK2-PD12-Q00, LXK2-PD12-R00, LXK2-PD12-S00 LXK2-PH12-R00, LXK2-PH12-S00 LXK2-PL12-P00, LXK2-PL12-Q00, LXK2-PL12-R00 Source: www.luxeon.com KINGBRIGHT: KA-3528ASYC Source: www.kingbright.com
LED7 = added_parts:LED-RGB
Q1 Q117 = added_parts:SS8550
Q2 Q126-Q128 = added_parts:NTGS4111P
Q101-Q104 Q106-Q111 = added_parts:S8050
Q119 Q121 = added_parts:SI2301
R1-R18 R24-R38 R100-R110 R114-R167 R204-R214 R218-R220 R223-R229 R231 R300 R301 R303-R328 R330-R333 R344-R350 R352 R353 R401-R408 R411 R421 R422 R425 R900-R904 R932 R1000-R1008 = rcl:R-EU_: RESISTOR, European symbol
RN100-RN104 = added_parts:EXB38V
RT1 = added_parts:NTC
S1-S19 S1008-S1012 = added_parts:TX16S_BUTTON
S20 = added_parts:JTP1236B
S1000-S1005 = switch:TL39PO: TINY SWITCH ON OFF ON Source: http://www2.produktinfo.conrad.com/datenblaetter/700000-724999/705152-da-01-de-Subminiaturschalter_TL_36YO.pdf
S1006 = switch:TL36PO: TINY SWITCH ON - ON Source: http://www2.produktinfo.conrad.com/datenblaetter/700000-724999/705152-da-01-de-Subminiaturschalter_TL_36YO.pdf
S1007 = switch:TL32PO: TINY SWITCH ON - MOM Source: http://www2.produktinfo.conrad.com/datenblaetter/700000-724999/705152-da-01-de-Subminiaturschalter_TL_36YO.pdf
S1013 S1014 = added_parts:TX16S_BUTTON2
TP1 TP100-TP105 TP113 TP115 TP116 TP1000-TP1004 = testpad:TPSQ: Test pad
VR1000-VR1003 = pot:EVU: 9 mm Square Rotary Potentiometers Source: Panasonic
X1 = con-lumberg:KLBR4: Jack connectors according to JISC 6560, 3.5 mm Klinkeneinbaukupplung nach JISC 6560, 3,5 mm, 3-polig/ stereo, abgewinkelte Ausführung, mit Öffner, für Leiterplatten Source: Data sheet <http://www.lumberg.com/Produkte/PDFs/KLBR4.pdf>; MPN: KLBR 4; OC_FARNELL: 1217016; OC_NEWARK: 97K2709
Y100 = added_parts:CRYSTAL
Y101 = added_parts:CRYSTAL_SHIELD